# EAGLE design Node#2 (EAGLE 9.2.1)

## Sheet 1 of 5
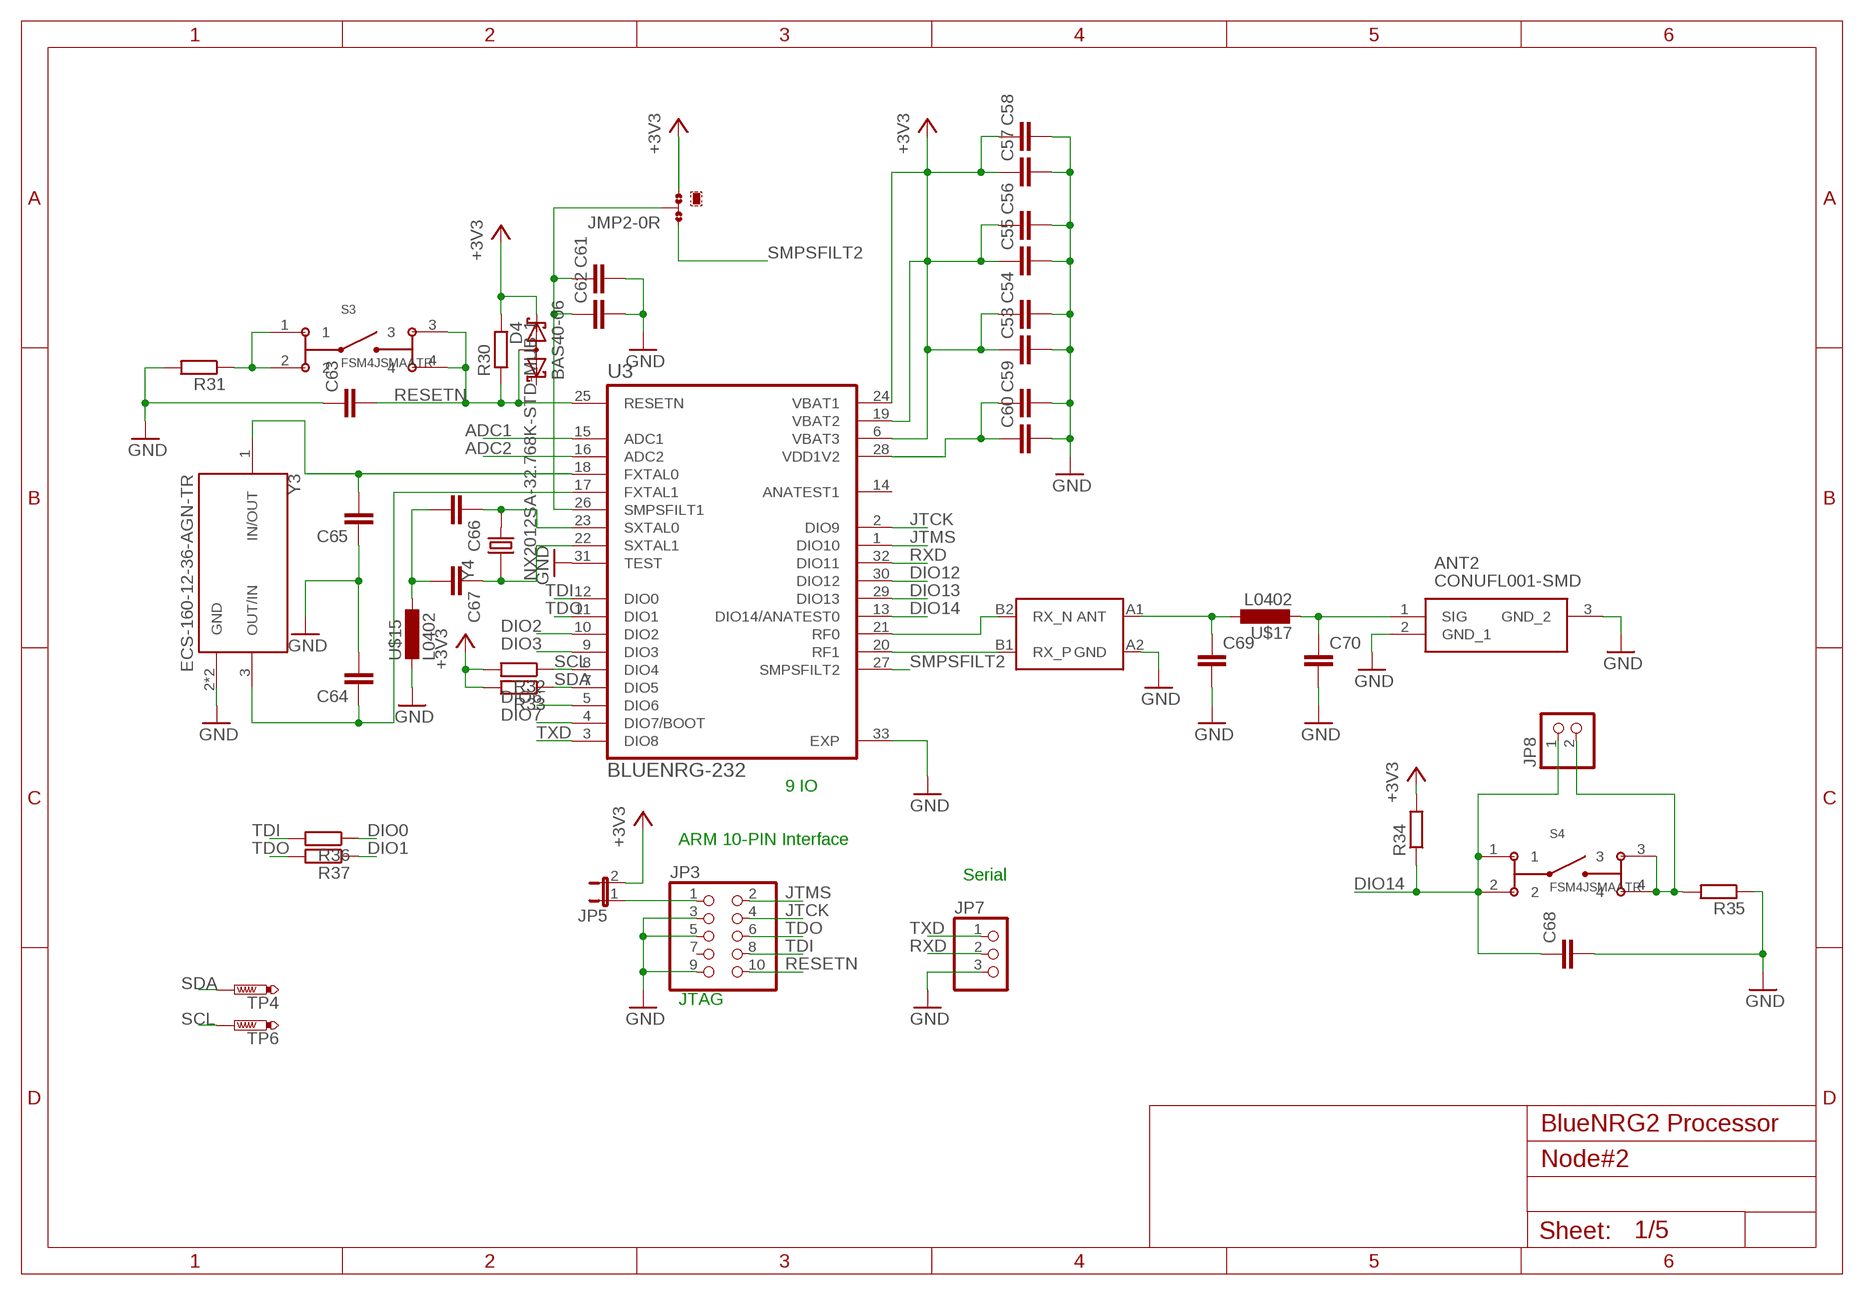
[diagram p0: schematic, sheet 1]

### Parts
ANT2  CONUFL001-SMD  [CONUFL001-SMD]
C53  C-EUC0805K  [C0805K]
C54  C-EUC0805K  [C0805K]
C55  C-EUC0805K  [C0805K]
C56  C-EUC0805K  [C0805K]
C57  C-EUC0805K  [C0805K]
C58  C-EUC0805K  [C0805K]
C59  C-EUC0805K  [C0805K]
C60  C-EUC0805K  [C0805K]
C61  C-EUC0805K  [C0805K]
C62  C-EUC0805K  [C0805K]
C63  C-EUC0805  [C0805]
C64  C-EUC0805  [C0805]
C65  C-EUC0805  [C0805]
C66  C-EUC0805  [C0805]
C67  C-EUC0805  [C0805]
C68  C-EUC0805  [C0805]
C69  C-EUC0402  [C0402]
C70  C-EUC0402  [C0402]
D4  BAS40-06  [SOT23]
JMP2  0R-JUMPA  [A0R-JMP]
JP3  PINHD-2X5  [2X05]
JP5  JP1E  [JP1]
JP7  PINHD-1X3  [1X03]
JP8  PINHD-1X2  [1X02]
R30  R-EU_R0805  [R0805]
R31  R-EU_R0805  [R0805]
R32  R-EU_R0805  [R0805]
R33  R-EU_R0805  [R0805]
R34  R-EU_R1210  [R1210]
R35  R-EU_R1210  [R1210]
R36  R-EU_R0805  [R0805]
R37  R-EU_R0805  [R0805]
S3  FSM4JSMAATR  [SW_FSM4JSMAATR]
S4  FSM4JSMAATR  [SW_FSM4JSMAATR]
TP4  PTR1TP20R  [TP20R]
TP6  PTR1TP20R  [TP20R]
U3  BLUENRG-232  [QFN50P500X500X100-33T345N]
U$15  L0402  [R0402]
U$16  BALF-NRG-01D3  [FLIPCHIP]
U$17  L0402  [R0402]
Y3  ECS-160-12-36-AGN-TR  [XTAL_ECS-160-12-36-AGN-TR]
Y4  NX2012SA-32.768K-STD-MUB-1  [XTAL_NX2012SA-32.768K-STD-MUB-1]

### Nets
+3V3: C53.1 C54.1 C55.1 C56.1 C57.1 C58.1 D4.2(K2) JMP2.3 JP5.2 R30.2 R32.2 R33.2 R34.2 U3.6(VBAT3) U3.19(VBAT2) U3.24(VBAT1) ; also sheet 2,3,4,5
ADC1: U3.15(ADC1) ; also sheet 5
ADC2: U3.16(ADC2) ; also sheet 5
DIO0: R36.1 ; also sheet 3
DIO1: R37.1 ; also sheet 3
DIO2: U3.10(DIO2) ; also sheet 3
DIO3: U3.9(DIO3) ; also sheet 5
DIO6: U3.5(DIO6) ; also sheet 5
DIO7: U3.4(DIO7/BOOT) ; also sheet 5
DIO12: U3.30(DIO12) ; also sheet 5
DIO13: U3.29(DIO13) ; also sheet 4
DIO14: C68.1 JP8.1 R34.1 S4.1 S4.2 U3.13(DIO14/ANATEST0)
GND: ANT2.2(GND_1) ANT2.3(GND_2) C53.2 C54.2 C55.2 C56.2 C57.2 C58.2 C59.2 C60.2 C61.2 C62.2 C63.1 C64.2 C65.1 C68.2 C69.2 C70.2 JP3.3 JP3.5 JP3.9 JP7.3 R31.2 R35.1 U3.31(TEST) U3.33(EXP) U$15.2 U$16.A2(GND) Y3.2(GND) Y3.4(GND) ; also sheet 2,3,4,5
JTCK: JP3.4 U3.2(DIO9)
JTMS: JP3.2 U3.1(DIO10)
N$47: C59.1 C60.1 U3.28(VDD1V2)
N$48: C61.1 C62.1 JMP2.2 U3.26(SMPSFILT1)
N$49: R31.1 S3.1 S3.2
N$50: C64.1 U3.17(FXTAL1) Y3.3(OUT/IN)
N$51: C65.2 U3.18(FXTAL0) Y3.1(IN/OUT)
N$52: C66.2 C67.2 U$15.1
N$53: C66.1 U3.23(SXTAL0) Y4.2
N$54: C67.1 U3.22(SXTAL1) Y4.1
N$55: C69.1 U$16.A1(ANT) U$17.1
N$56: ANT2.1(SIG) C70.1 U$17.2
N$57: JP3.1 JP5.1
N$58: JP8.2 R35.2 S4.3 S4.4
N$59: U3.20(RF1) U$16.B1(RX_P)
N$60: U3.21(RF0) U$16.B2(RX_N)
RESETN: C63.2 D4.3(AA) JP3.10 R30.1 S3.3 S3.4 U3.25(RESETN) ; also sheet 3,4
RXD: JP7.2 U3.32(DIO11)
SCL: R32.1 TP6.TP U3.8(DIO4) ; also sheet 4,5
SDA: R33.1 TP4.TP U3.7(DIO5) ; also sheet 4,5
SMPSFILT2: JMP2.1 U3.27(SMPSFILT2)
TDI: JP3.8 R36.2 U3.12(DIO0)
TDO: JP3.6 R37.2 U3.11(DIO1)
TXD: JP7.1 U3.3(DIO8)
Unconnected: D4.1(K1) JP3.7 U3.14(ANATEST1)

### Notes on the sheet
- 9 IO
- ARM 10-PIN Interface
- Serial
- JTAG
- BlueNRG2 Processor

## Sheet 2 of 5
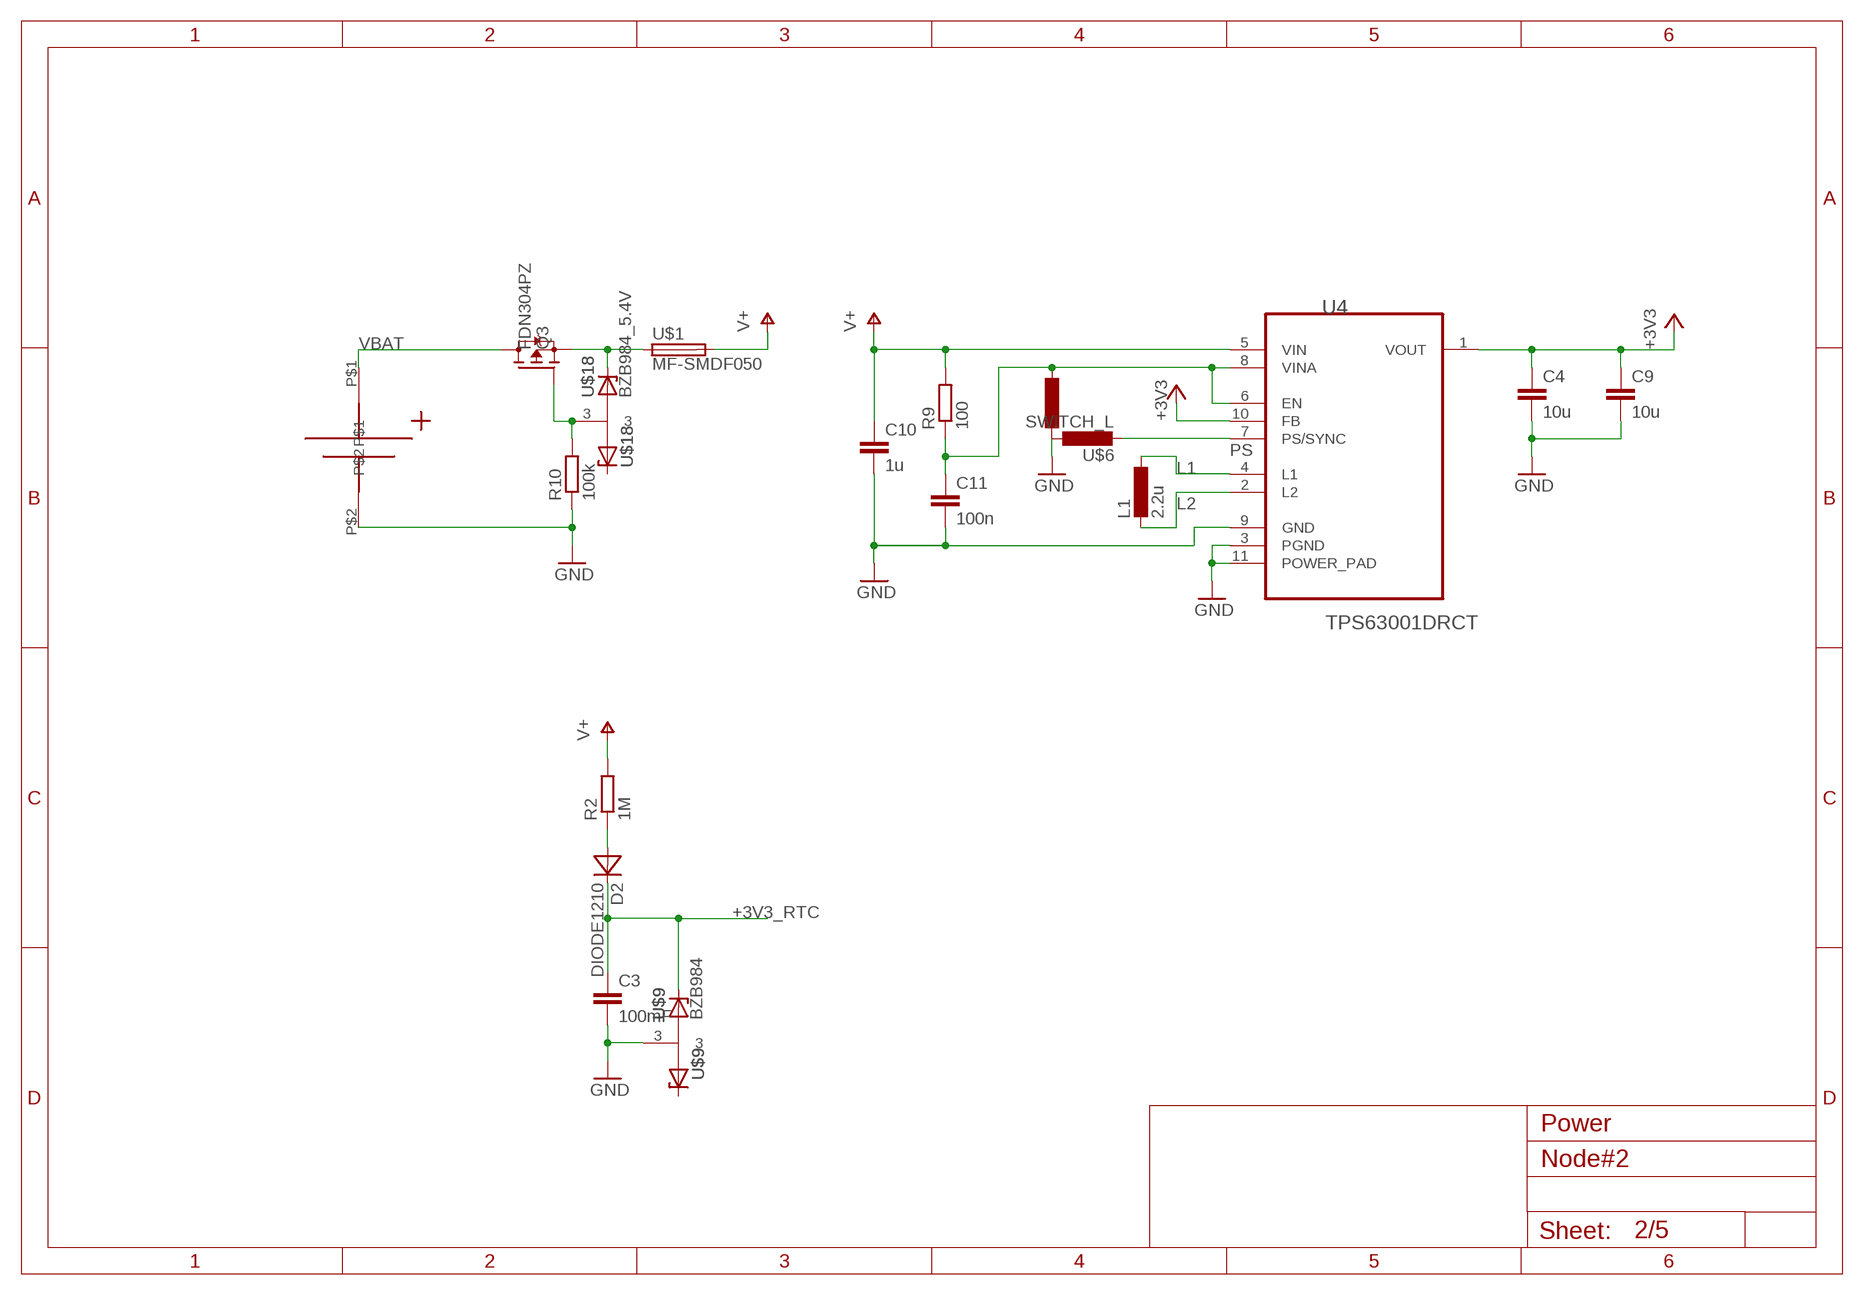
[diagram p1: schematic, sheet 2]

### Parts
C3  100mF  C-EU050-055X075  [C050-055X075]
C4  10u  C-EUC0805  [C0805]
C9  10u  C-EUC0805  [C0805]
C10  1u  C-EUC0805  [C0805]
C11  100n  C-EUC0805  [C0805]
D2  DIODE1210  [C1210]
L1  2.2u  LSWUERTH  [L5038P]
Q3  FDN304PZ  [SOT23]
R2  1M  R-EU_R0805  [R0805]
R9  100  R-EU_R0805  [R0805]
R10  100k  R-EU_R0805  [R0805]
U4  TPS63001DRCT  [SON50P300X300X100-11N]
U$1  MF-SMDF050  [MF-SMDF050]
U$6  SWITCH_L  [R0805_2]
U$9  BZB984  [SOT95P230X110-3N]
U$10  BATTER_HOLDER  [BATTERY_HOLDER]
U$18  BZB984_5.4V  BZB984  [SOT95P230X110-3N]

### Nets
+3V3: C4.1 C9.1 U4.1(VOUT) U4.10(FB) ; also sheet 1,3,4,5
+3V3_RTC: C3.1 D2.2(C) U$9.2 ; also sheet 5
GND: C3.2 C4.2 C9.2 C10.2 C11.2 R10.1 U4.3(PGND) U4.9(GND) U4.11(POWER_PAD) U$6.2 U$9.3 U$10.P$2 ; also sheet 1,3,4,5
L1: L1.1 U4.4(L1)
L2: L1.2 U4.2(L2)
N$1: D2.1(A) R2.1
N$8: Q3.2S(S) U$1.1 U$18.2
N$12: C11.1 R9.1 U4.6(EN) U4.8(VINA) U$6.3
N$14: Q3.1G(G) R10.2 U$18.3
PS: U4.7(PS/SYNC) U$6.1
V+: C10.1 R2.2 R9.2 U4.5(VIN) U$1.2 ; also sheet 5
VBAT: Q3.3D(D) U$10.P$1
Unconnected: U$9.1 U$18.1

### Notes on the sheet
- Power

## Sheet 3 of 5
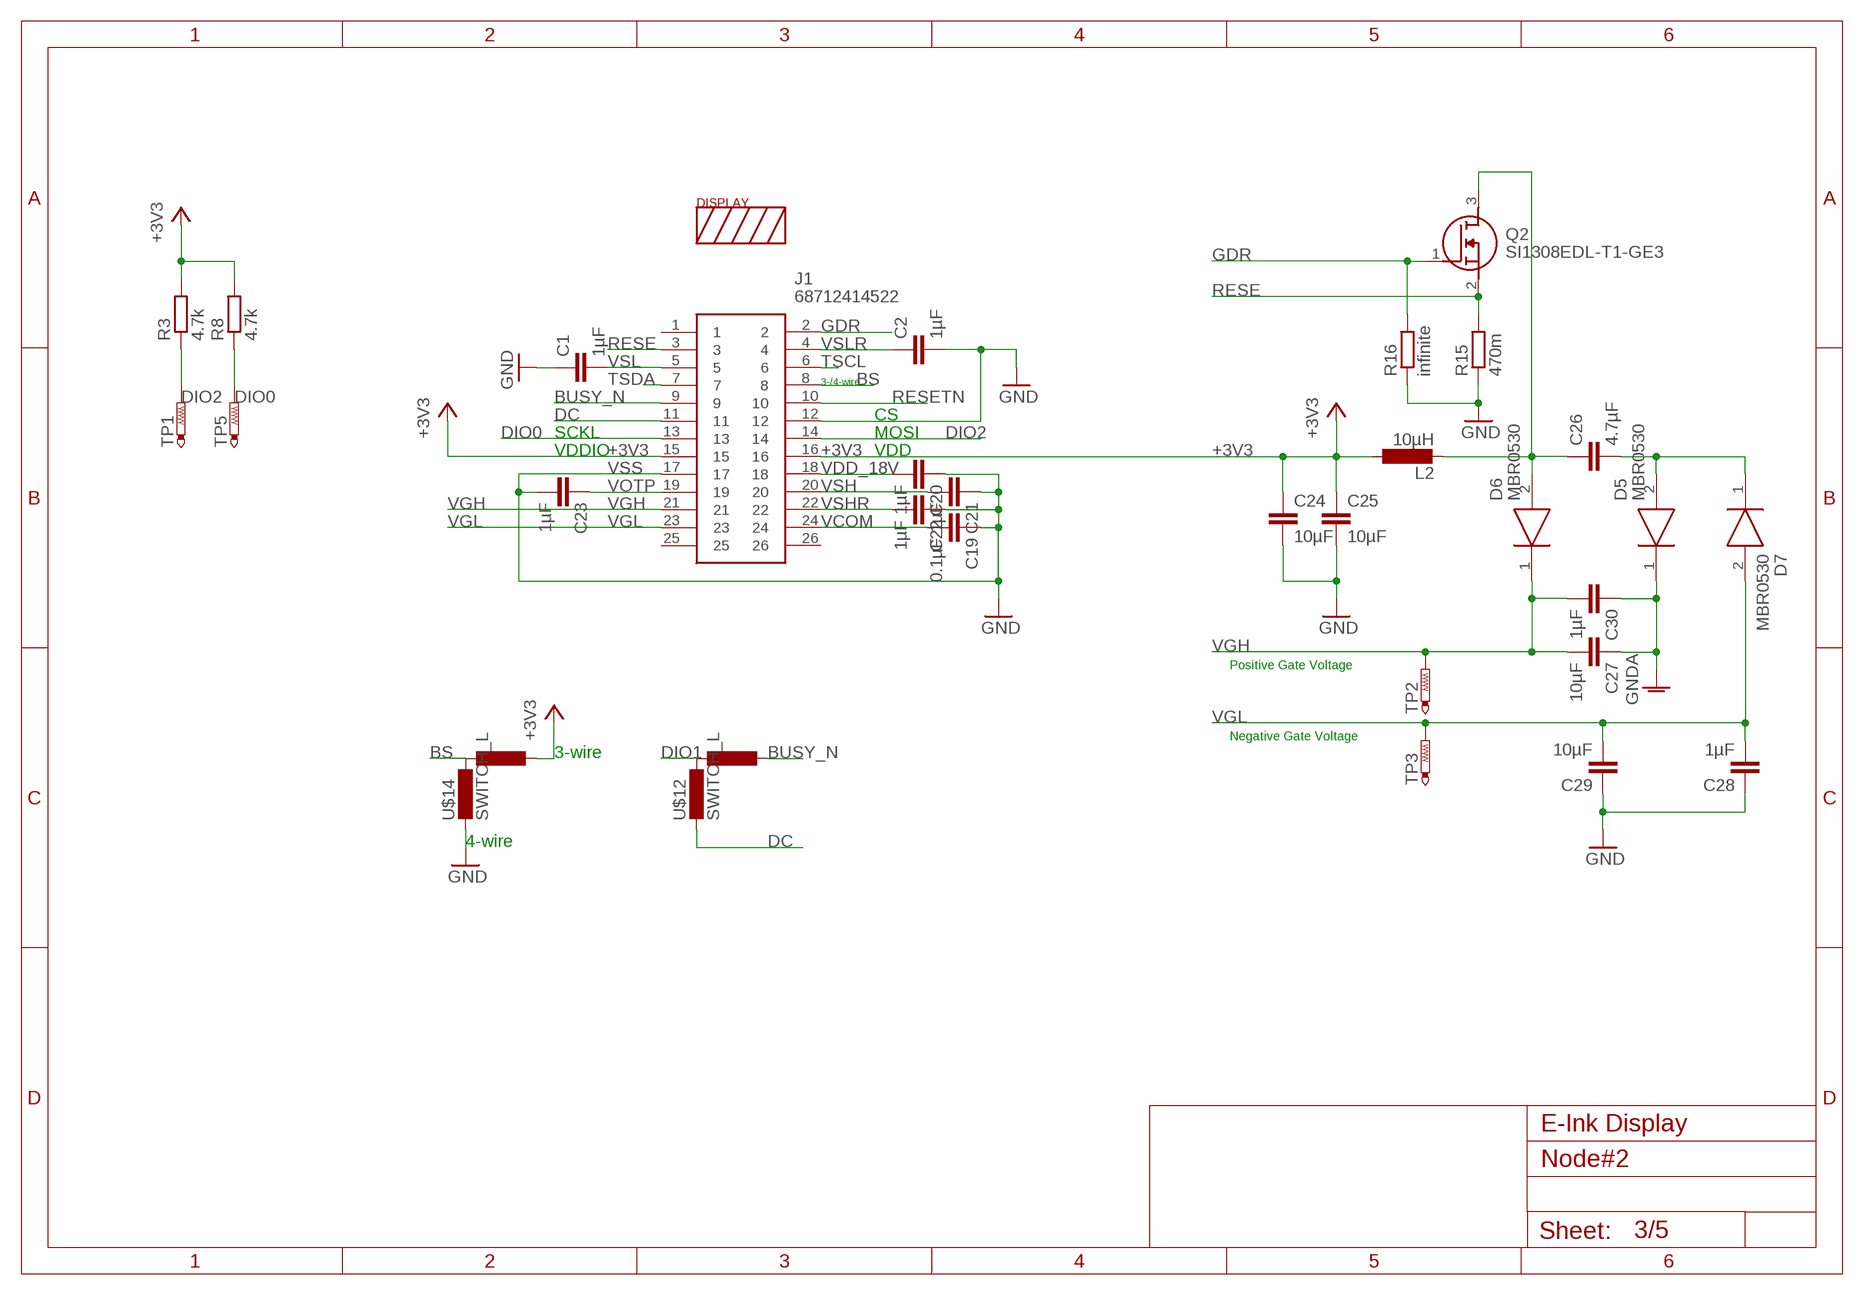
[diagram p2: schematic, sheet 3]

### Parts
C1  1µF  C-EUC0805  [C0805]
C2  1µF  C-EUC0805  [C0805]
C19  0.1µF  C-EUC0805  [C0805]
C20  1µF  C-EUC0805  [C0805]
C21  1µF  C-EUC0805  [C0805]
C22  1µF  C-EUC0805  [C0805]
C23  1µF  C-EUC0805  [C0805]
C24  10µF  C-EUC0805  [C0805]
C25  10µF  C-EUC0805  [C0805]
C26  4.7µF  C-EUC0805  [C0805]
C27  10µF  C-EUC0805  [C0805]
C28  1µF  C-EUC0805  [C0805]
C29  10µF  C-EUC0805  [C0805]
C30  1µF  C-EUC0805  [C0805]
D5  MBR0530  [SOD3716X135N]
D6  MBR0530  [SOD3716X135N]
D7  MBR0530  [SOD3716X135N]
J1  68712414522  [68712414522]
L2  10µH  LSWUERTH  [L5038P]
Q2  SI1308EDL-T1-GE3  [SOT65P210X110-3N]
R3  4.7k  R-EU_R0805  [R0805]
R8  4.7k  R-EU_R0805  [R0805]
R15  470m  R-EU_R0805  [R0805]
R16  infinite  R-EU_R0805  [R0805]
TP1  PTR1TP20R  [TP20R]
TP2  PTR1TP20R  [TP20R]
TP3  PTR1TP20R  [TP20R]
TP5  PTR1TP20R  [TP20R]
U$11  DISPLAY  [DISPLAY]
U$12  SWITCH_L  [R0805_2]
U$14  SWITCH_L  [R0805_2]

### Nets
+3V3: C24.1 C25.1 J1.15 J1.16 L2.1 R3.2 R8.2 U$14.3 ; also sheet 1,2,4,5
BS: J1.8 U$14.2
BUSY_N: J1.9 U$12.3
DC: J1.11 U$12.1
DIO0: J1.13 R8.1 TP5.TP ; also sheet 1
DIO1: U$12.2 ; also sheet 1
DIO2: J1.14 R3.1 TP1.TP ; also sheet 1
GDR: J1.2 Q2.1(G) R16.2
GND: C1.1 C2.2 C24.2 C25.2 C27.1 C28.1 C29.1 C30.1 D5.1(K) J1.12 R15.1 R16.1 U$14.1 ; supply symbol labelled GNDA ; also sheet 1,2,4,5
N$23: C26.1 D6.2(A) L2.2 Q2.3(D)
N$24: C26.2 D5.2(A) D7.1(K)
RESE: J1.3 Q2.2(S) R15.2
RESETN: J1.10 ; also sheet 1,4
TSCL: J1.6
TSDA: J1.7
VCOM: C19.2 J1.24
VDD_18V: C20.2 J1.18
VGH: C27.2 C30.2 D6.1(K) J1.21 TP2.TP
VGL: C28.2 C29.2 D7.2(A) J1.23 TP3.TP
VOTP: C23.1 J1.19
VSH: C21.2 J1.20
VSHR: C22.2 J1.22
VSL: C1.2 J1.5
VSLR: C2.1 J1.4
VSS: C19.1 C20.1 C21.1 C22.1 C23.2 J1.17 ; supply symbol labelled GND
Unconnected: J1.1 J1.25 J1.26

### Notes on the sheet
- 3-/4-wire
- CS
- SCKL | MOSI
- VDDIO | VDD
- Positive Gate Voltage
- Negative Gate Voltage
- 3-wire
- 4-wire
- E-Ink Display

## Sheet 4 of 5
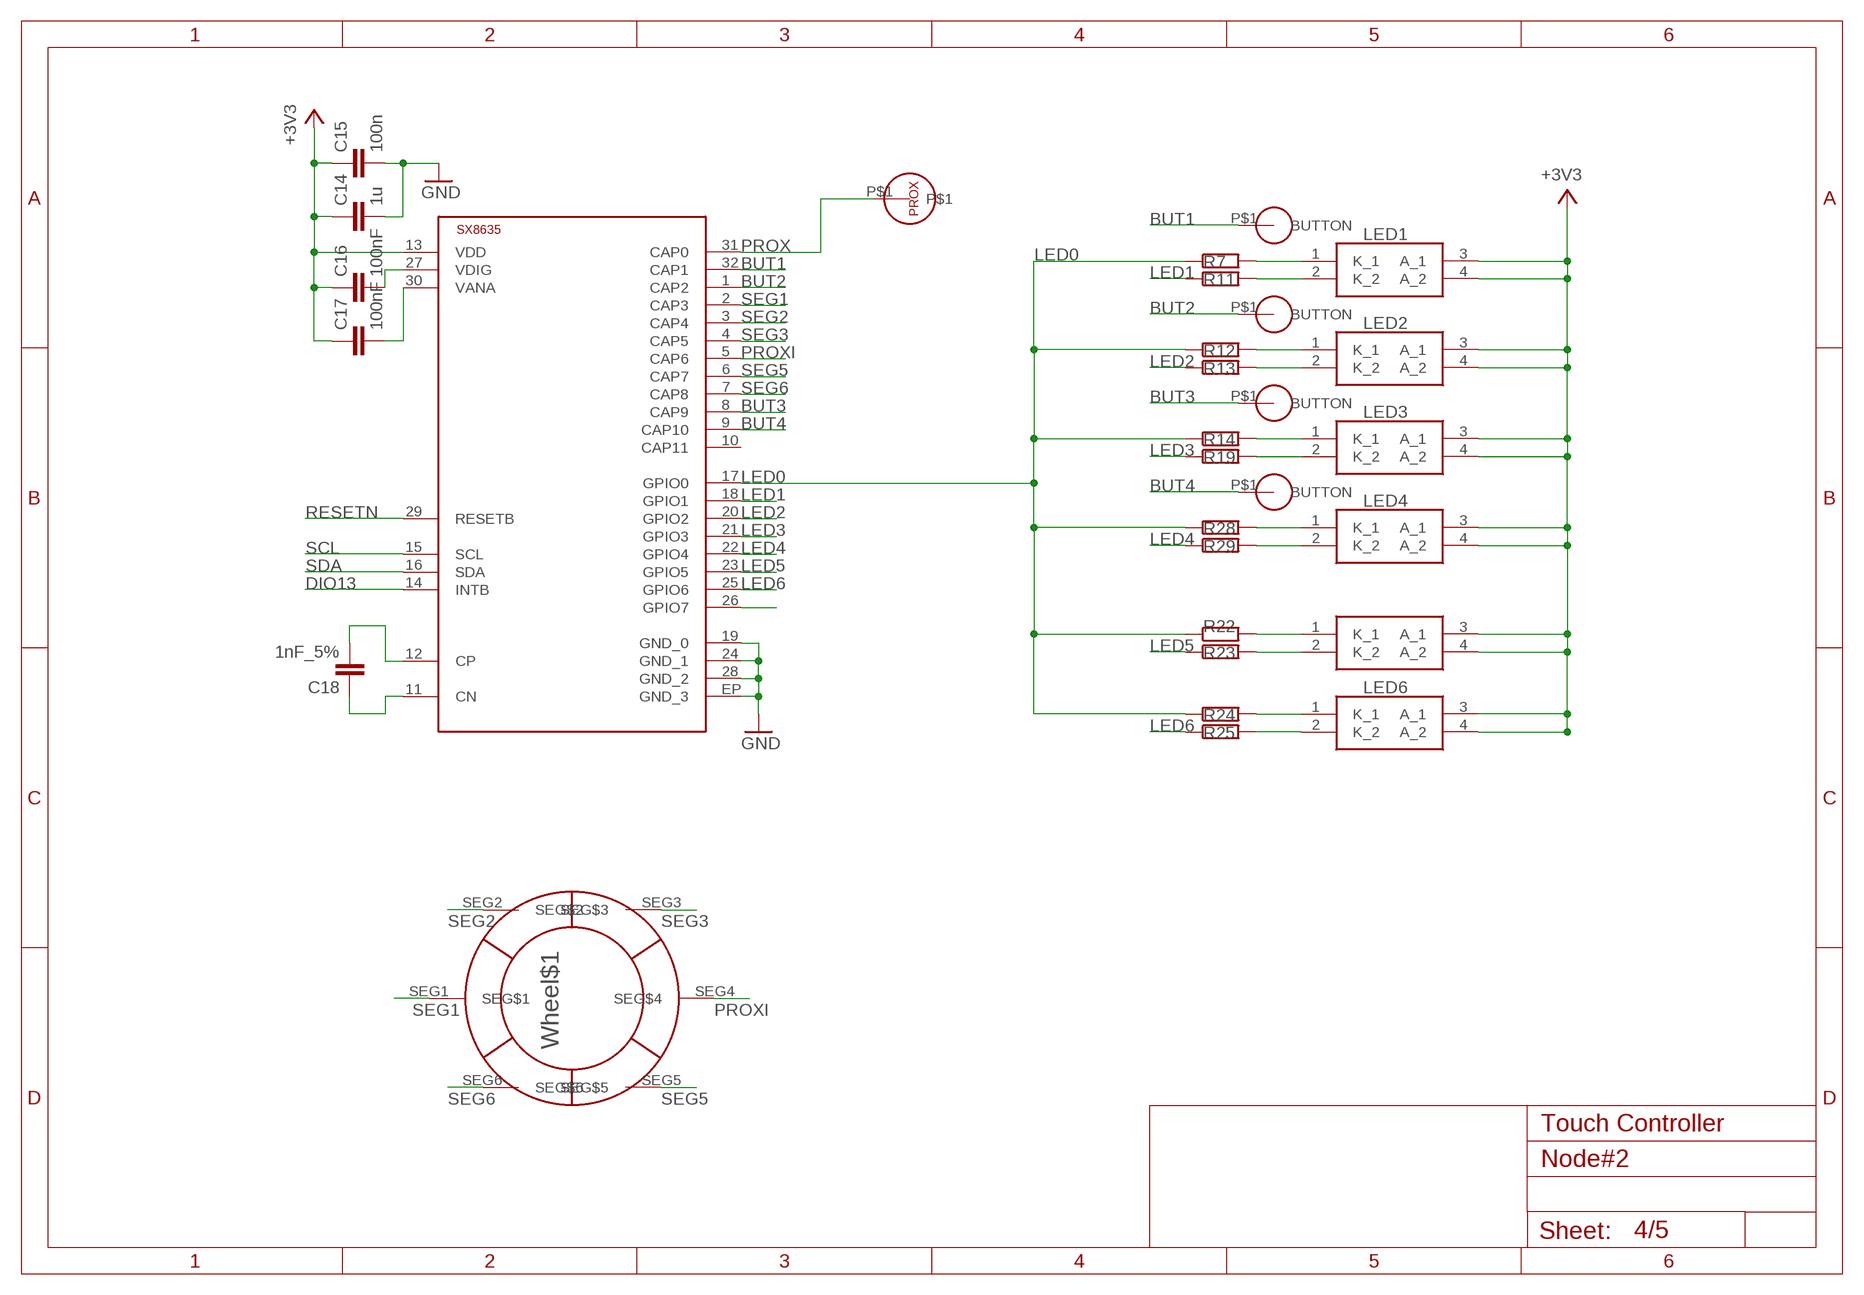
[diagram p3: schematic, sheet 4]

### Parts
C14  1u  C-EUC0805  [C0805]
C15  100n  C-EUC0805  [C0805]
C16  100nF  C-EUC0805  [C0805]
C17  100nF  C-EUC0805  [C0805]
C18  1nF_5%  C-EUC0805  [C0805]
LED1  156125YV73000  [156125YV73000]
LED2  156125YV73000  [156125YV73000]
LED3  156125YV73000  [156125YV73000]
LED4  156125YV73000  [156125YV73000]
LED5  156125YV73000  [156125YV73000]
LED6  156125YV73000  [156125YV73000]
PROXI  PROXIMITY  [PROXIMITY]
R7  R-EU_R0805  [R0805]
R11  R-EU_R0805  [R0805]
R12  R-EU_R0805  [R0805]
R13  R-EU_R0805  [R0805]
R14  R-EU_R0805  [R0805]
R19  R-EU_R0805  [R0805]
R22  R-EU_R0805  [R0805]
R23  R-EU_R0805  [R0805]
R24  R-EU_R0805  [R0805]
R25  R-EU_R0805  [R0805]
R28  R-EU_R0805  [R0805]
R29  R-EU_R0805  [R0805]
U$2  SX8635  [QFN-32]
U$3  TOUCH_BUTTON  [TOUCH_BUTTON]
U$4  TOUCH_BUTTON  [TOUCH_BUTTON]
U$5  TOUCH_BUTTON  [TOUCH_BUTTON]
U$13  TOUCH_BUTTON  [TOUCH_BUTTON]
U$19  WHEEL6  [WHEEL6]

### Nets
+3V3: C14.1 C15.1 C16.1 C17.1 LED1.3(A_1) LED1.4(A_2) LED2.3(A_1) LED2.4(A_2) LED3.3(A_1) LED3.4(A_2) LED4.3(A_1) LED4.4(A_2) LED5.3(A_1) LED5.4(A_2) LED6.3(A_1) LED6.4(A_2) U$2.13(VDD) ; also sheet 1,2,3,5
BUT1: U$2.32(CAP1) U$3.P$1(BUTTON)
BUT2: U$2.1(CAP2) U$4.P$1(BUTTON)
BUT3: U$2.8(CAP9) U$5.P$1(BUTTON)
BUT4: U$2.9(CAP10) U$13.P$1(BUTTON)
DIO13: U$2.14(INTB) ; also sheet 1
GND: C14.2 C15.2 U$2.19(GND_0) U$2.24(GND_1) U$2.28(GND_2) U$2.EP(GND_3) ; also sheet 1,2,3,5
LED0: R7.1 R12.1 R14.1 R22.1 R24.1 R28.1 U$2.17(GPIO0)
LED1: R11.1 U$2.18(GPIO1)
LED2: R13.1 U$2.20(GPIO2)
LED3: R19.1 U$2.21(GPIO3)
LED4: R29.1 U$2.22(GPIO4)
LED5: R23.1 U$2.23(GPIO5)
LED6: R25.1 U$2.25(GPIO6)
N$4: LED1.1(K_1) R7.2
N$5: LED1.2(K_2) R11.2
N$7: LED3.1(K_1) R14.2
N$13: LED3.2(K_2) R19.2
N$16: LED5.1(K_1) R22.2
N$17: LED5.2(K_2) R23.2
N$18: C16.2 U$2.27(VDIG)
N$19: C17.2 U$2.30(VANA)
N$20: C18.2 U$2.12(CP)
N$21: C18.1 U$2.11(CN)
N$25: LED2.1(K_1) R12.2
N$26: LED2.2(K_2) R13.2
N$30: LED4.1(K_1) R28.2
N$31: LED4.2(K_2) R29.2
N$35: U$2.26(GPIO7)
N$36: LED6.1(K_1) R24.2
N$37: LED6.2(K_2) R25.2
PROX: PROXI.P$1 U$2.31(CAP0)
PROXI: U$2.5(CAP6) U$19.SEG4(SEG$4)
RESETN: U$2.29(RESETB) ; also sheet 1,3
SCL: U$2.15(SCL) ; also sheet 1,5
SDA: U$2.16(SDA) ; also sheet 1,5
SEG1: U$2.2(CAP3) U$19.SEG1(SEG$1)
SEG2: U$2.3(CAP4) U$19.SEG2(SEG$2)
SEG3: U$2.4(CAP5) U$19.SEG3(SEG$3)
SEG5: U$2.6(CAP7) U$19.SEG5(SEG$5)
SEG6: U$2.7(CAP8) U$19.SEG6(SEG$6)
Unconnected: U$2.10(CAP11)

### Notes on the sheet
- Touch Controller

## Sheet 5 of 5
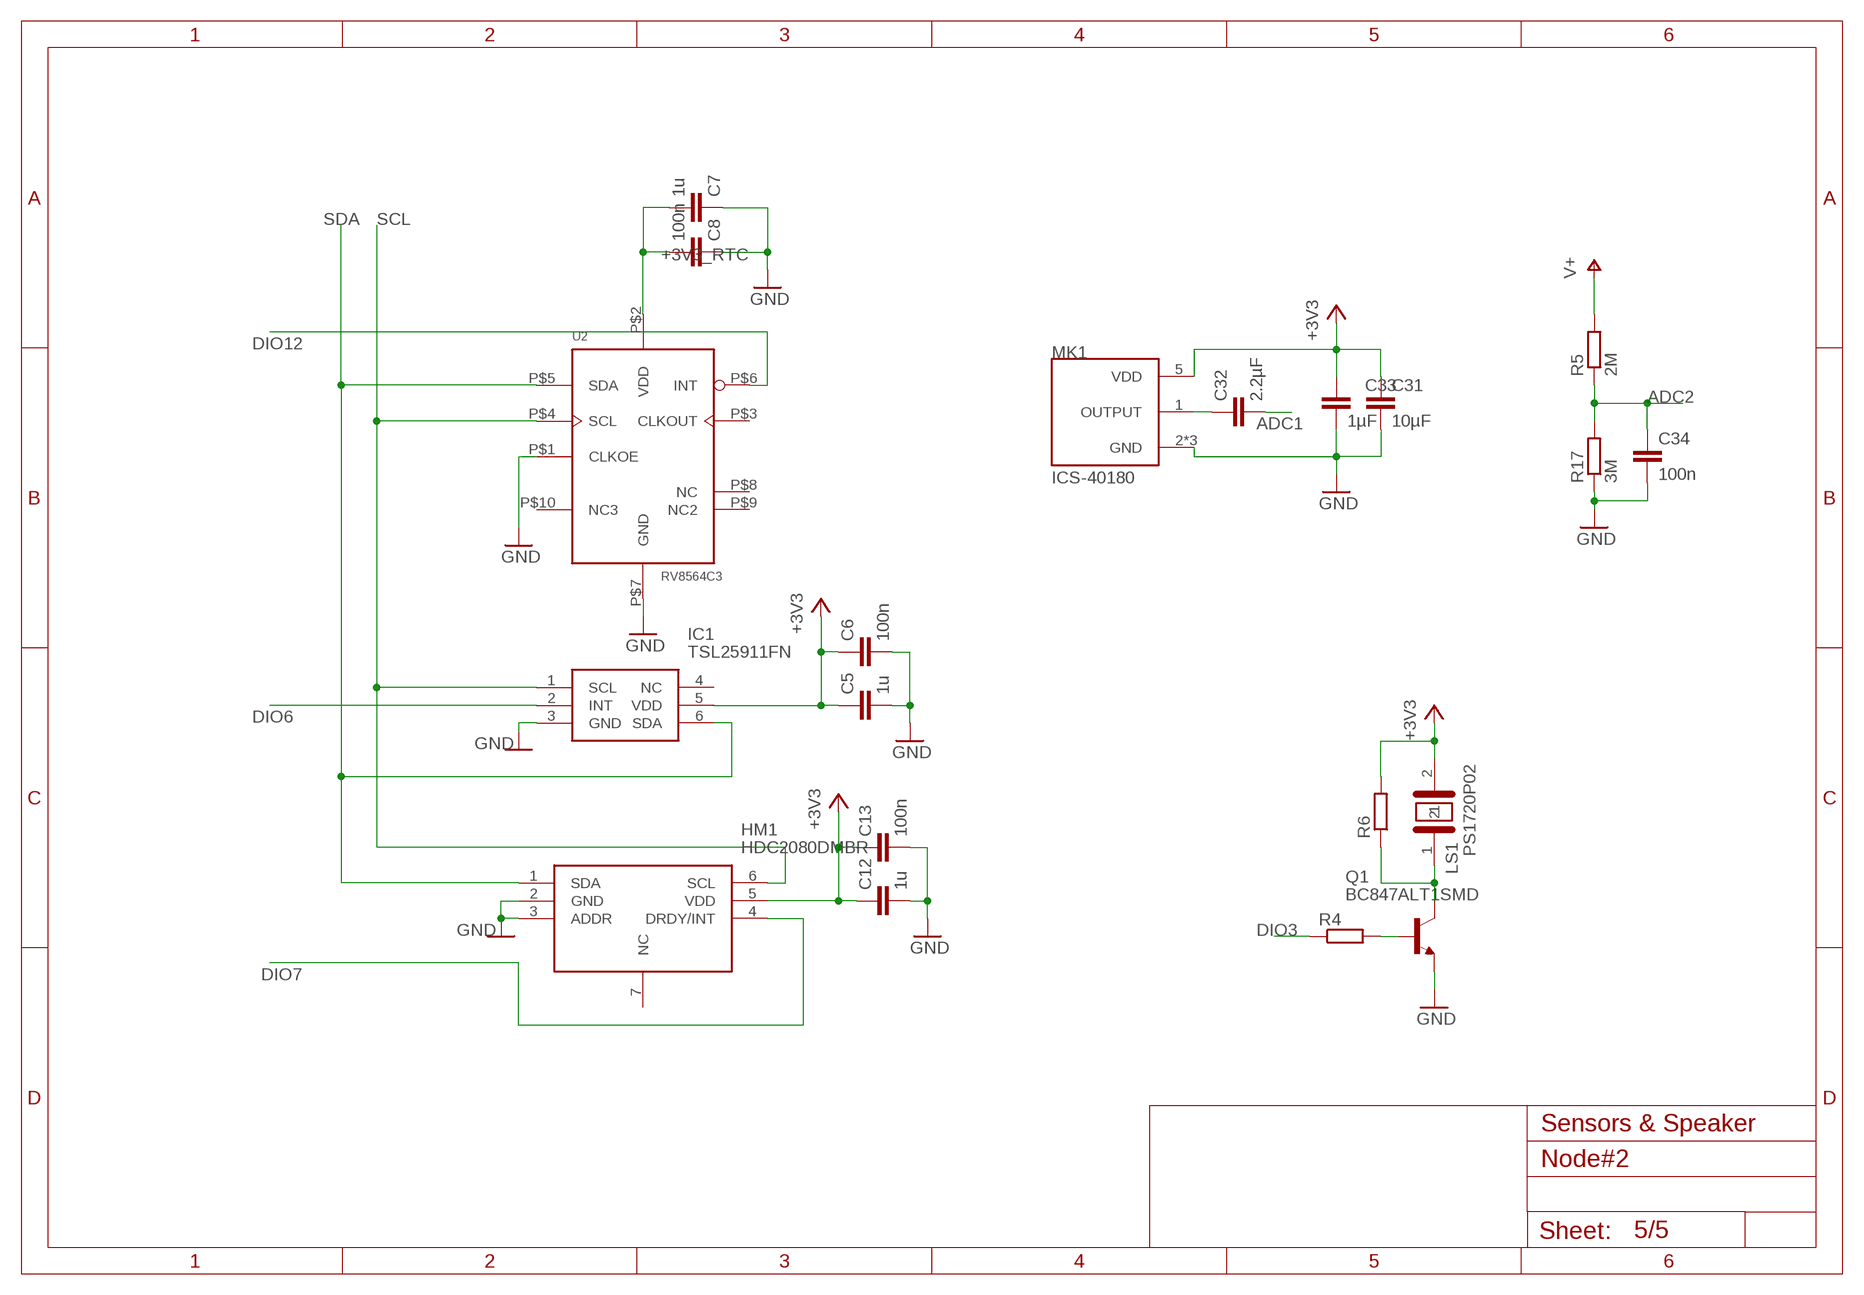
[diagram p4: schematic, sheet 5]

### Parts
C5  1u  C-EUC0805  [C0805]
C6  100n  C-EUC0805  [C0805]
C7  1u  C-EUC0805  [C0805]
C8  100n  C-EUC0805  [C0805]
C12  1u  C-EUC0805  [C0805]
C13  100n  C-EUC0805  [C0805]
C31  10µF  C-EUC0805  [C0805]
C32  2.2µF  C-EUC0805  [C0805]
C33  1µF  C-EUC0805  [C0805]
C34  100n  C-EUC0805  [C0805]
HM1  HDC2080DMBR  [SON100P300X300X80-7N]
IC1  TSL25911FN  [TSL25911FN]
LS1  PS1720P02  [PS17_1]
MK1  ICS-40180  [MIC_ICS-40180]
Q1  BC847ALT1SMD  [SOT23]
R4  R-EU_R0805  [R0805]
R5  2M  R-EU_R0805  [R0805]
R6  R-EU_R0805  [R0805]
R17  3M  R-EU_R0805  [R0805]
U2  RV8564C3  [RTC-C3]

### Nets
+3V3: C5.1 C6.1 C12.1 C13.1 C31.1 C33.1 HM1.5(VDD) IC1.5(VDD) LS1.2 MK1.5(VDD) R6.2 ; also sheet 1,2,3,4
+3V3_RTC: C7.2 C8.2 U2.P$2(VDD) ; also sheet 2
ADC1: C32.2 ; also sheet 1
ADC2: C34.1 R5.1 R17.2 ; also sheet 1
DIO3: R4.1 ; also sheet 1
DIO6: IC1.2(INT) ; also sheet 1
DIO7: HM1.4(DRDY/INT) ; also sheet 1
DIO12: U2.P$6(INT) ; also sheet 1
GND: C5.2 C6.2 C7.1 C8.1 C12.2 C13.2 C31.2 C33.2 C34.2 HM1.2(GND) HM1.3(ADDR) IC1.3(GND) MK1.2(GND) MK1.3(GND) MK1.4(GND) Q1.2(E) R17.1 U2.P$1(CLKOE) U2.P$7(GND) ; also sheet 1,2,3,4
N$2: C32.1 MK1.1(OUTPUT)
N$3: LS1.1 Q1.3(C) R6.1
N$6: Q1.1(B) R4.2
SCL: HM1.6(SCL) IC1.1(SCL) U2.P$4(SCL) ; also sheet 1,4
SDA: HM1.1(SDA) IC1.6(SDA) U2.P$5(SDA) ; also sheet 1,4
V+: R5.2 ; also sheet 2
Unconnected: HM1.7(NC) IC1.4(NC) U2.P$3(CLKOUT) U2.P$8(NC) U2.P$9(NC2) U2.P$10(NC3)

### Notes on the sheet
- Sensors & Speaker

## Library data of the parts
ANT2 = BlueHome:CONUFL001-SMD: RF Connectors / Coaxial Connectors U.FL Straight Surface Mount Jack Source: Datasheet <https://componentsearchengine.com/Datasheets/1/CONUFL001-SMD.pdf>; DESCRIPTION: RF Connectors / Coaxial Connectors U.FL Straight Surface Mount Jack; HEIGHT: mm; MANUFACTURER_NAME: Linx Technologies; MANUFACTURER_PART_NUMBER: CONUFL001-SMD; MOUSER_PART_NUMBER: 712-CONUFL001-SMD
C1 C2 C19-C30 = rcl:C-EU: CAPACITOR, European symbol; SPICEPREFIX: C
C3-C18 C31-C34 C53-C70 = rcl:C-EU: CAPACITOR, European symbol
D2 = BlueHome:DIODE1210
D4 = diode:BAS40-06: Silicon Schottky Diodes General-purpose diode for high-speed switching
D5-D7 = BlueHome:MBR0530: ON SEMICONDUCTOR - MBR0530 - DIODE, SCHOTTKY, 0.5A, 30V, SOD-123 Source: Datasheet <https://www.mouser.com/datasheet/2/308/MBR0530-1301245.pdf>; DESCRIPTION: ON SEMICONDUCTOR - MBR0530 - DIODE, SCHOTTKY, 0.5A, 30V, SOD-123; HEIGHT: 1.35mm; MANUFACTURER_NAME: ON Semiconductor; MANUFACTURER_PART_NUMBER: MBR0530; MOUSER_PART_NUMBER: 512-MBR0530; SPICEPREFIX: D
HM1 = BlueHome:HDC2080DMBR: Board Mount Humidity Sensors Low Power Humidity and Temperature Digital Sensor 6-WSON -40 to 85 Source: Datasheet <http://www.ti.com/general/docs/suppproductinfo.tsp?distId=26&gotoUrl=http://www.ti.com/lit/ds/symlink/hdc2080.pdf>; DESCRIPTION: Board Mount Humidity Sensors Low Power Humidity and Temperature Digital Sensor 6-WSON -40 to 85; HEIGHT: 0.8mm; MANUFACTURER_NAME: Texas Instruments; MANUFACTURER_PART_NUMBER: HDC2080DMBR; MOUSER_PART_NUMBER: 595-HDC2080DMBR
IC1 = BlueHome:TSL25911FN: Sensitivity Ambient Light Sensor DFN6 Source: Datasheet <https://componentsearchengine.com/Datasheets/1/TSL25911FN.pdf>; DESCRIPTION: Sensitivity Ambient Light Sensor DFN6; HEIGHT: 0mm; MANUFACTURER_NAME: ams; MANUFACTURER_PART_NUMBER: TSL25911FN; MOUSER_PART_NUMBER: 985-TSL25911FN
J1 = BlueHome:68712414522: WR-FPC 0.5mm ZIF Connector Bottom 24pin Wurth Elektronik 687 Series 0.5mm Pitch 24 Way Straight SMT FPC Connector Source: Datasheet <https://componentsearchengine.com/Datasheets/1/68712414522.pdf>; DESCRIPTION: WR-FPC 0.5mm ZIF Connector Bottom 24pin Wurth Elektronik 687 Series 0.5mm Pitch 24 Way Straight SMT FPC Connector; HEIGHT: 2mm; MANUFACTURER_NAME: Wurth Elektronik; MANUFACTURER_PART_NUMBER: 68712414522; MOUSER_PART_NUMBER: 710-68712414522; SPICEPREFIX: X
JMP2 = jump-0r-smd:0R-JUMP: SMD 0R 0805 Jumper
JP3 = pinhead:PINHD-2X5: PIN HEADER
JP5 = jumper:JP1E: JUMPER
JP7 = pinhead:PINHD-1X3: PIN HEADER
JP8 = pinhead:PINHD-1X2: PIN HEADER
L1 = BlueHome:LSWUERTH; SPICEPREFIX: L
L2 = BlueHome:LSWUERTH
LED1-LED6 = BlueHome:156125YV73000: Standard LEDs - SMD WL-SBRW SMD 1205 YBG 592/573nm Source: Datasheet <https://componentsearchengine.com/Datasheets/1/156125YV73000.pdf>; DESCRIPTION: Standard LEDs - SMD WL-SBRW SMD 1205 YBG 592/573nm; HEIGHT: 0.8mm; MANUFACTURER_NAME: Wurth Elektronik; MANUFACTURER_PART_NUMBER: 156125YV73000; MOUSER_PART_NUMBER: 710-156125YV73000
LS1 = BlueHome:PS1720P02: Piezoelectronic buzzers Pin terminal/Lead lines/SMD(Without oscillator circuit) Source: Datasheet <https://componentsearchengine.com/Datasheets/1/PS1720P02.pdf>; DESCRIPTION: Piezoelectronic buzzers Pin terminal/Lead lines/SMD(Without oscillator circuit); HEIGHT: mm; MANUFACTURER_NAME: TDK; MANUFACTURER_PART_NUMBER: PS1720P02; MOUSER_PART_NUMBER: 810-PS1720P02
MK1 = BlueHome:ICS-40180: RF Hardened, Low Noise Analog Output; AVAILABILITY: Unavailable; DESCRIPTION: RF Hardened, Low Noise Analog Output; MF: TDK InvenSense; MP: ICS-40180; PACKAGE: LGA-5 TDK-InvenSense; PRICE: None
PROXI = BlueHome:PROXIMITY
Q1 = transistor-npn:BC847*: NPN Transistor
Q2 = BlueHome:SI1308EDL-T1-GE3: MOSFET N-Ch 30V 1.5A TrenchFET SC70 Vishay Si1308EDL-T1-GE3 N-channel MOSFET Transistor, 1.5 A, 30 V, 3-Pin SC-70 Source: Datasheet <https://componentsearchengine.com/Datasheets/1/SI1308EDL-T1-GE3.pdf>; DESCRIPTION: MOSFET N-Ch 30V 1.5A TrenchFET SC70 Vishay Si1308EDL-T1-GE3 N-channel MOSFET Transistor, 1.5 A, 30 V, 3-Pin SC-70; HEIGHT: 1.1mm; MANUFACTURER_NAME: Vishay; MANUFACTURER_PART_NUMBER: Si1308EDL-T1-GE3; MOUSER_PART_NUMBER: 78-SI1308EDL-T1-GE3; SPICEPREFIX: Q
Q3 = BlueHome:FDN304PZ
R2-R6 R8-R10 R17 R30-R37 = rcl:R-EU_: RESISTOR, European symbol
R7 R11-R16 R19 R22-R25 R28 R29 = rcl:R-EU_: RESISTOR, European symbol; SPICEPREFIX: R
S3 S4 = BlueHome:FSM4JSMAATR: Switch Tactile OFF (ON) SPST Round Button Gull Wing 0.05A 24VDC 2.6N SMD T/R; AVAILABILITY: Unavailable; DESCRIPTION: Switch Tactile OFF _ON_ SPST Round Button Gull Wing 0.05A 24VDC 2.6N SMD T/R; MF: TE Connectivity; MP: FSM4JSMAATR; PACKAGE: None; PRICE: None; TE_PURCHASE_URL: https://www.te.com/usa-en/product-FSM4JSMAATR.html?te_bu=Cor&te_type=disp&te_campaign=seda_glo_cor-seda-global-disp-prtnr-fy19-seda-model-bom-cta_sma-317_1&elqCampaignId=32493
TP1-TP6 = testpad:PTR1: TEST PIN
U2 = BlueHome:RV8564C3: Real Time Clock |SM| 3.7 x 2.5 mm | I2C Bus Sub miniature size AEC Q200 Rev C compliant Compliant with I2C-Bus interface (400kHz) Built in crystal for adjustment-free operation Programmable alarm, timer and interrupt functions Low power consumption datasheet <http://www.golledge.com/docs/products/rtcs/rv8564c3.htm?src=eagle>; AVAILABILITY: Unavailable; DESCRIPTION: Rtc Module 20ppm -40/+85; MF: Micro Crystal; MP: RV-8564-C3; PACKAGE: None; PRICE: None
U3 = BlueHome:BLUENRG-232: Bluetooth Low Energy Wireless Soc; AVAILABILITY: Unavailable; DESCRIPTION: Bluetooth Low Energy Wireless Soc; MF: STMicroelectronics; MP: BLUENRG-232; PACKAGE: VFQFN-32 STMicroelectronics; PRICE: None
U4 = BlueHome:TPS63001DRCT: HIGH EFFICIENT SINGLE INDUCTOR BUCK-BOOST CONVERTER WITH 1.8-A SWITCHES; AVAILABILITY: Unavailable; DESCRIPTION: 96% Buck-Boost Converter with 1.7A Current Switches, 3.3V fixed Output voltage in 3x3 QFN 10-VSON -40 to 85; MF: Texas Instruments; MP: TPS63001DRCT; PACKAGE: VSON-10 Texas Instruments; PRICE: None
U$1 = fuse:MF-SMDF: MF-SMDF Series - PRC Resettable Fuses Source: http://www.farnell.com/datasheets/716597.pdf
U$2 = BlueHome:SX8635
U$3-U$5 U$13 = BlueHome:TOUCH_BUTTON
U$6 U$12 U$14 = BlueHome:SWITCH_L
U$9 U$18 = BlueHome:BZB984
U$10 = BlueHome:BATTER_HOLDER
U$11 = BlueHome:DISPLAY; SPICEPREFIX: X
U$15 U$17 = BlueHome:L
U$16 = BlueHome:BALF-NRG-01D3; AVAILABILITY: Unavailable; DESCRIPTION: 50 Ω nominal input / conjugate match balun to BlueNRG transceiver, with integrated harmonic filter; MF: STMicroelectronics; MP: BALF-NRG-01D3; PACKAGE: WFBGA-4 STMicroelectronics; PRICE: None
U$19 = BlueHome:WHEEL6
Y3 = BlueHome:ECS-160-12-36-AGN-TR: The minature ECX-2236 is a compact SMD Crystal. The industry standard 2.5 x 2.0 x 0.55 mm ceramic package is ideal for today’s SMD manufacturing environment.; AVAILABILITY: Unavailable; DESCRIPTION: Crystal 16MHz ±25ppm _Tol_ ±30ppm _Stability_ 12pF FUND 80Ohm 4-Pin Mini-CSMD T/R; MF: ECS Inc.; MP: ECS-160-12-36-AGN-TR; PACKAGE: SMD-4 ECS International; PRICE: None
Y4 = BlueHome:NX2012SA-32.768K-STD-MUB-1: Crystal 32.7680khz 12.5pf Smd; AVAILABILITY: Unavailable; DESCRIPTION: Crystal 32.7680khz 12.5pf Smd; MF: NDK America,; MP: NX2012SA-32.768K-STD-MUB-1; PACKAGE: SMD-2 NDK; PRICE: None

## Module DISPLAY
Ports: 

### Library data of the parts

## Board
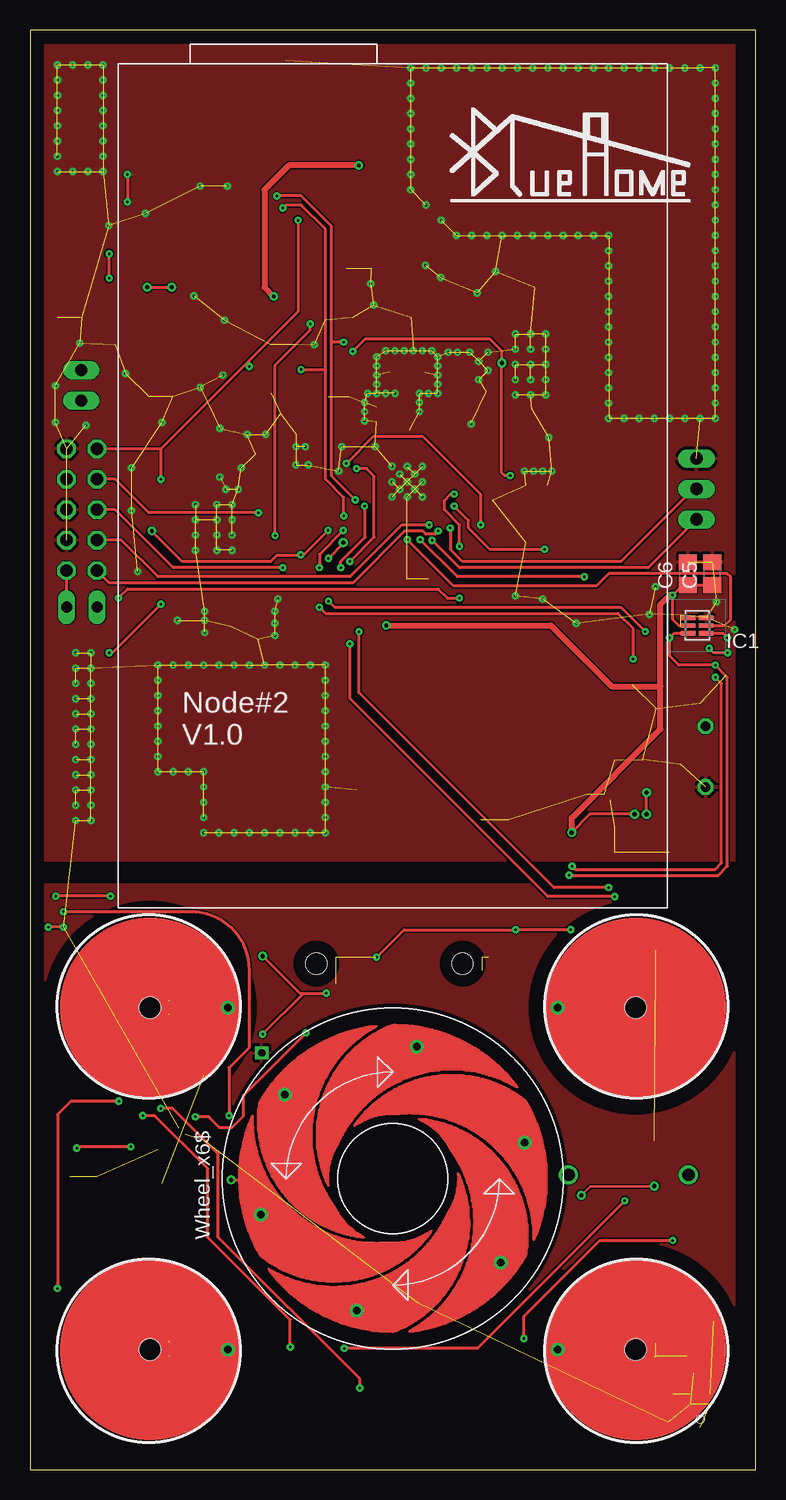
[diagram p5: board, top side]
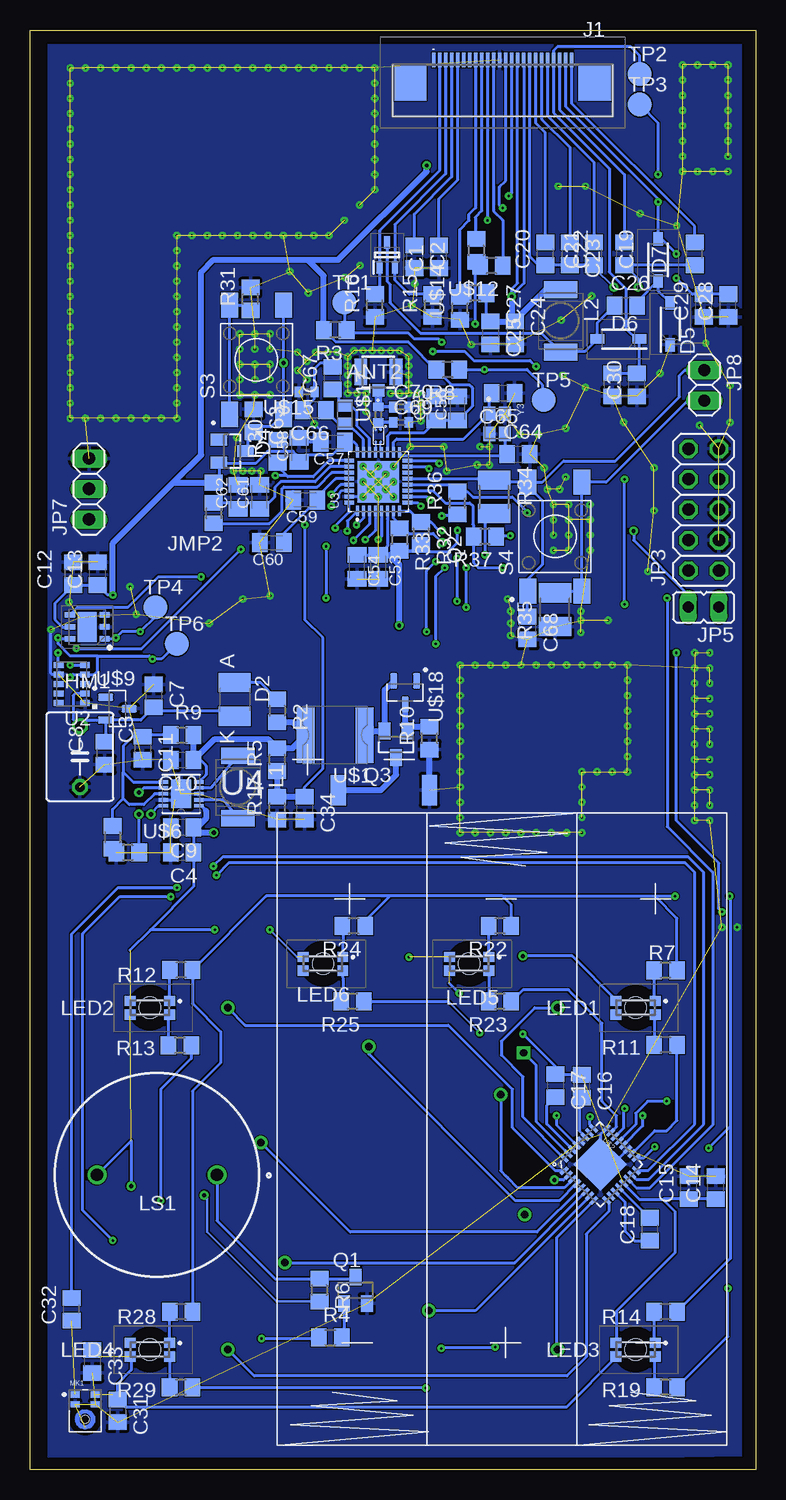
[diagram p6: board, bottom side, seen from below]

Size 60.5 x 120 mm. Coordinates in mm from the lower left corner, seen from the top.
Outline: 0,0 60.5,0 60.5,120 0,120 0,0
Copper layers (1*16): Top 0.035mm / dielectric 1.5mm / Bottom 0.035mm
Design rules "default *": minimum track width 8mil, minimum drill 8mil, track to track 4mil, track to pad 4mil, pad to pad 4mil, via to via 4mil, smd to smd 4mil, copper to edge 40mil, drill to drill 6mil, minimum pad ring 10mil, minimum via ring 8mil, stop-mask expansion 4mil, vias tented up to drill 0mil, thermal gap 10mil
Holes 1.75 mm at 23.88,42.16 36.07,42.16
tRestrict: area 0,0 to 60.5,120
bRestrict: area 0,0 to 60.5,120

### Footprints (pad centres in the part's own frame; a part is rotated, then mirrored left to right if it is on the bottom)
CONUFL001-SMD = smd 1 x 1.05: 1 0,-1.525 | smd 1.05 x 2.2: 2 -1.475,0; 3 1.475,0
C0805 = smd 1.3 x 1.5: 1 -0.95,0; 2 0.95,0
C050-055X075 = drill 0.813 octagon: 1 -2.54,0; 2 2.54,0
C0805K = smd 1.3 x 1.6: 1 -1,0; 2 1,0
C0402 = smd 0.7 x 0.9: 1 -0.65,0; 2 0.65,0
C1210 = smd 1.6 x 2.7: 1 -1.4,0; 2 1.4,0
SOT23 = smd 1 x 1.4: 1 -0.95,-1.1; 2 0.95,-1.1; 3 0,1.1
SOD3716X135N = smd 1.15 x 0.8: 1 -1.75,0; 2 1.75,0
SON100P300X300X80-7N = smd 0.85 x 0.45: 1 -1.45,1; 2 -1.45,0; 3 -1.45,-1; 4 1.45,-1; 5 1.45,0; 6 1.45,1 | smd 1.6 x 2.5: 7 0,0
TSL25911FN = smd 1.2 x 0.35: 1 -0.75,0.65; 2 -0.75,0; 3 -0.75,-0.65; 4 0.75,-0.65; 5 0.75,0; 6 0.75,0.65
68712414522 = smd 0.3 x 1.2: 1 -5.75,1.875; 2 -5.25,1.875; 3 -4.75,1.875; 4 -4.25,1.875; 5 -3.75,1.875; 6 -3.25,1.875; 7 -2.75,1.875; 8 -2.25,1.875; 9 -1.75,1.875; 10 -1.25,1.875; 11 -0.75,1.875; 12 -0.25,1.875; 13 0.25,1.875; 14 0.75,1.875; 15 1.25,1.875; 16 1.75,1.875; 17 2.25,1.875; 18 2.75,1.875; 19 3.25,1.875; 20 3.75,1.875; 21 4.25,1.875; 22 4.75,1.875; 23 5.25,1.875; 24 5.75,1.875 | smd 2.7 x 3: 25 -7.68,-0.025; 26 7.68,-0.025
A0R-JMP = smd 1.5 x 1.3: 1 0,1.7; 2 0,0; 3 0,-1.7
2X05 = drill 1.016 octagon: 1 -5.08,-1.27; 2 -5.08,1.27; 3 -2.54,-1.27; 4 -2.54,1.27; 5 0,-1.27; 6 0,1.27; 7 2.54,-1.27; 8 2.54,1.27; 9 5.08,-1.27; 10 5.08,1.27
JP1 = drill 0.914 long: 1 0,-1.27; 2 0,1.27
1X03 = drill 1.016 long: 1 -2.54,0; 2 0,0; 3 2.54,0
1X02 = drill 1.016 long: 1 -1.27,0; 2 1.27,0
L5038P = smd 1.4 x 2.8: 1 -2.6,0; 2 2.6,0
156125YV73000 = smd 0.9 x 0.85: 1 -1.65,-0.575; 2 -1.65,0.575; 3 1.65,0.575; 4 1.65,-0.575
PS17_1 = drill 1.02 pad 1.58: 1 -5,0; 2 5,0
MIC_ICS-40180 = smd 0.725 x 0.522: 1 -0.838,1.361; 2 -0.838,0.539; 4 0.838,0.539; 5 0.838,1.361 | smd 0.2 x 0.2: 3 -0.015,-1.383 | hole 0.65: 0,-0.713
PROXIMITY = drill 0.6 square: P$1 0,0
SOT65P210X110-3N = smd 1.05 x 0.5: 1 -1.05,0.65; 2 -1.05,-0.65; 3 1.05,0
SOT23' = smd 1 x 1.4: 1G -0.95,-1.1; 2S 0.95,-1.1; 3D 0,1.1
R0805 = smd 1.3 x 1.5: 1 -0.95,0; 2 0.95,0
R1210 = smd 1.6 x 2.7: 1 -1.4,0; 2 1.4,0
SW_FSM4JSMAATR = smd 2.1 x 1.4: 1 -4.55,2.25; 2 4.55,2.25; 3 -4.55,-2.25; 4 4.55,-2.25
TP20R = smd 2 x 2: TP 0,0
RTC-C3 = smd 0.8 x 0.5: P$1 -1.1,1.6; P$2 -1.1,0.8; P$3 -1.1,0; P$4 -1.1,-0.8; P$5 -1.1,-1.6; P$6 1.1,-1.6; P$7 1.1,-0.8; P$8 1.1,0; P$9 1.1,0.8; P$10 1.1,1.6
QFN50P500X500X100-33T345N = smd 0.84 x 0.29: 1 -2.435,1.75; 2 -2.435,1.25; 3 -2.435,0.75; 4 -2.435,0.25; 5 -2.435,-0.25; 6 -2.435,-0.75; 7 -2.435,-1.25; 8 -2.435,-1.75; 17 2.435,-1.75; 18 2.435,-1.25; 19 2.435,-0.75; 20 2.435,-0.25; 21 2.435,0.25; 22 2.435,0.75; 23 2.435,1.25; 24 2.435,1.75 | smd 0.29 x 0.84: 9 -1.75,-2.435; 10 -1.25,-2.435; 11 -0.75,-2.435; 12 -0.25,-2.435; 13 0.25,-2.435; 14 0.75,-2.435; 15 1.25,-2.435; 16 1.75,-2.435; 25 1.75,2.435; 26 1.25,2.435; 27 0.75,2.435; 28 0.25,2.435; 29 -0.25,2.435; 30 -0.75,2.435; 31 -1.25,2.435; 32 -1.75,2.435 | smd 3.45 x 3.45: 33 0,0
SON50P300X300X100-11N = smd 0.813 x 0.305: 1 -1.473,0.991; 2 -1.473,0.508; 3 -1.473,0; 4 -1.473,-0.508; 5 -1.473,-0.991; 6 1.473,-0.991; 7 1.473,-0.508; 8 1.473,0; 9 1.473,0.508; 10 1.473,0.991 | smd 1.651 x 2.388: 11 0,0
MF-SMDF050 = smd 1.5 x 4.6: 1 -2.45,0; 2 2.45,0
QFN-32 = smd 0.285 x 0.8: 1 -1.75,-2.5; 2 -1.25,-2.5; 3 -0.75,-2.5; 4 -0.25,-2.5; 5 0.25,-2.5; 6 0.75,-2.5; 7 1.25,-2.5; 8 1.75,-2.5; 17 1.75,2.5; 18 1.25,2.5; 19 0.75,2.5; 20 0.25,2.5; 21 -0.25,2.5; 22 -0.75,2.5; 23 -1.25,2.5; 24 -1.75,2.5 | smd 0.8 x 0.285: 9 2.5,-1.75; 10 2.5,-1.25; 11 2.5,-0.75; 12 2.5,-0.25; 13 2.5,0.25; 14 2.5,0.75; 15 2.5,1.25; 16 2.5,1.75; 25 -2.5,1.75; 26 -2.5,1.25; 27 -2.5,0.75; 28 -2.5,0.25; 29 -2.5,-0.25; 30 -2.5,-0.75; 31 -2.5,-1.25; 32 -2.5,-1.75 | smd 3.15 x 3.15: EP 0,0
TOUCH_BUTTON = drill 0.6: P$1 6.5,0 | hole 1.75: 0,0
R0805_2 = smd 1.5 x 1.3: 1 0,-2.22; 2 0,-0.32 | smd 1.3 x 1.5: 3 2.22,0; 4 0.32,0
SOT95P230X110-3N = smd 1.26 x 0.59: 1 -0.98,0.95; 2 -0.98,-0.95; 3 0.98,0
BATTERY_HOLDER = smd 1.27 x 2.54: P$1 5.08,54.61; P$2 12.7,54.61
R0402 = smd 0.7 x 0.9: 1 -0.65,0; 2 0.65,0
FLIPCHIP = smd 0.255 x 0.255: A1 -0.5,0.2; A2 -0.5,-0.2; B1 0.5,0.2; B2 0.5,-0.2
WHEEL6 = drill 0.6: SEG1 -3,11; SEG2 7,9; SEG3 11,-2; SEG4 3,-11; SEG5 -7,-9; SEG6 -11,3
XTAL_ECS-160-12-36-AGN-TR = smd 1.2 x 1: 1 -0.85,-0.65; 2 0.85,-0.65; 3 0.85,0.65; 4 -0.85,0.65
XTAL_NX2012SA-32.768K-STD-MUB-1 = smd 1 x 1.25: 1 -0.75,0; 2 0.75,0

### Placement (x,y rotation side)
ANT2  31.46,91.49 0 bottom
C1  26.42,101.09 90 bottom
C2  28.45,101.09 270 bottom
C3  56.34,59.42 270 bottom
C4  47.82,51.43 180 bottom
C5  56.9,74.68 90 top
C6  54.86,74.68 90 top
C7  50.18,64.51 270 bottom
C8  54.25,59.71 90 bottom
C9  47.82,53.53 180 bottom
C10  47.82,59.13 180 bottom
C11  51.12,60.13 270 bottom
C12  56.9,74.68 90 bottom
C13  54.86,74.68 90 bottom
C14  3.3,23.5 90 bottom
C15  5.55,23.5 90 bottom
C16  14.5,31.95 270 bottom
C17  16.7,32 270 bottom
C18  8.8,20.03 90 bottom
C19  5.08,101.35 90 bottom
C20  17.53,101.35 90 bottom
C21  13.46,101.35 90 bottom
C22  10.92,101.35 90 bottom
C23  15.49,101.35 270 bottom
C24  20.07,94.74 270 bottom
C25  22.1,94.74 270 bottom
C26  10.81,97.03 0 bottom
C27  11.94,90.42 90 bottom
C28  2.29,97.03 90 bottom
C29  4.32,97.03 90 bottom
C30  9.91,90.42 90 bottom
C31  53.2,4.9 270 bottom
C32  57.04,13.36 90 bottom
C33  55.3,9 270 bottom
C34  37.59,55.12 270 bottom
C53  31.46,75.23 270 bottom
C54  33.23,75.23 270 bottom
C55  26.63,88.44 90 bottom
C56  24.85,88.44 90 bottom
C57  35.27,85.65 180 bottom
C58  38.06,85.01 90 bottom
C59  37.55,80.82 180 bottom
C60  40.35,77.27 180 bottom
C61  41.36,81.08 90 bottom
C62  43.14,81.08 90 bottom
C63  41.87,87.43 270 bottom
C64  19.77,84.63 0 bottom
C65  21.04,89.71 180 bottom
C66  36.79,88.31 180 bottom
C67  35.27,90.98 90 bottom
C68  19.01,70.15 270 bottom
C69  29.55,87.3 0 bottom
C70  29.55,88.57 0 bottom
D2  43.44,64.19 270 bottom
D4  43.65,84.89 270 bottom
D5  7.11,95.5 90 bottom
D6  11.43,94.23 180 bottom
D7  8.13,100.84 90 bottom
HM1  55.72,70.24 180 bottom
IC1  55.63,70.36 180 top
J1  21.09,115.62 0 bottom
JMP2  45.17,80.57 180 bottom
JP3  4.32,80.01 90 bottom
JP5  4.32,71.88 90 bottom
JP7  55.58,81.75 90 bottom
JP8  4.27,90.38 270 bottom
L1  43.18,56.9 270 bottom
L2  16.26,95.76 270 bottom
LED1  10,38.5 180 bottom
LED2  50.5,38.5 180 bottom
LED3  10,10 180 bottom
LED4  50.5,10 180 bottom
LED5  23.88,42.16 180 bottom
LED6  36.07,42.16 180 bottom
LS1  49.91,24.56 180 bottom
MK1  55.9,4.9 0 bottom
PROXI  19.33,34.73 0 top
Q1  33.36,14.94 0 bottom
Q2  30.72,101.25 90 bottom
Q3  FDN304PZ  [SOT23']  29.97,60.45 180 bottom
R2  39.88,63.25 270 bottom
R3  35.05,95 180 bottom
R4  35.46,11.01 0 bottom
R5  39.88,59.18 90 bottom
R6  36.37,14.96 270 bottom
R7  7.5,41.6 180 bottom
R8  25.65,91.69 180 bottom
R9  47.82,61.23 0 bottom
R10  27.18,60.96 90 bottom
R11  7.5,35.4 180 bottom
R12  47.9,41.65 180 bottom
R13  47.99,35.35 180 bottom
R14  7.5,13.15 180 bottom
R15  26.92,97.03 90 bottom
R16  31.75,97.03 90 bottom
R17  39.88,55.12 90 bottom
R19  7.49,6.85 180 bottom
R22  21.32,45.32 180 bottom
R23  21.32,39.01 180 bottom
R24  33.51,45.31 180 bottom
R25  33.61,39.02 180 bottom
R28  47.9,13.15 180 bottom
R29  47.91,6.85 180 bottom
R30  39.84,84.89 90 bottom
R31  42.12,97.59 90 bottom
R32  27.9,78.03 270 bottom
R33  29.68,77.52 270 bottom
R34  21.8,81.08 270 bottom
R35  16.72,71.68 90 bottom
R36  24.85,80.57 90 bottom
R37  22.57,77.77 180 bottom
S3  41.62,92.51 90 bottom
S4  16.72,77.77 90 bottom
TP1  34.29,97.28 0 bottom
TP2  9.65,116.33 0 bottom
TP3  9.65,113.79 0 bottom
TP4  50.04,71.88 0 bottom
TP5  17.65,89.15 0 bottom
TP6  48.26,68.83 0 bottom
U2  57.01,65.48 180 bottom
U3  31.46,82.35 90 bottom
U4  47.9,56.32 180 bottom
U$1  35.05,61.21 180 bottom
U$2  12.96,25.44 315.2 bottom
U$3  10,38.5 0 top
U$4  50.5,38.5 180 top
U$5  10,10 0 top
U$6  53.62,51.43 90 bottom
U$9  53.2,63.42 0 bottom
U$10  39.88,2.03 0 bottom
U$11  7.35,46.8 0 top
U$12  23.29,100.36 90 bottom
U$13  50.5,10 180 top
U$14  24.65,98.06 0 bottom
U$15  37.42,89.84 180 bottom
U$16  31.46,86.16 270 bottom
U$17  31.46,87.93 90 bottom
U$18  29.21,64.77 270 bottom
U$19  30.25,24.25 90 top
Y3  21.55,87.17 270 bottom
Y4  34.25,87.93 270 bottom

### Tracks (layer width: path | path; a pad name or v marks a point on that pad's centre or on a via)
+3V3  (via drill 0.2, 0.2 pad 0.2, 0.3, 0.35)  (17 unrouted)
  Top 0.203: 22.5,39.7 22.8,39.7 | v45.97,22.86 46.74,23.62 v52.07,23.62
  Top 0.254: v24.85,78.28 22.82,76.25 v22.57,76.25 22.52,76.2 20.57,76.2 20.07,75.69 12.7,75.69 v10.16,78.23 | v19.4,36.3 22.8,39.7 v24.7,39.7 | v28.9,42.7 31.2,45 v40.5,45 v45.1,45 | v19.4,42.8 22.5,39.7 | v50.42,54.63 46.71,54.63 v45.17,53.09 | C12.1 C13.1 54.42,73.73 v53.59,72.9 53.59,70.87 54.1,70.36 IC1.5
  Top 0.508: v45.17,53.09 45.17,54.31 52.58,61.72 52.58,65.28 | 52.58,65.28 52.58,72.14 53.34,72.9 v53.59,72.9 | v27.43,108.71 21.59,108.71 19.56,106.68 19.56,98.55 v20.32,97.79 | v29.72,70.36 43.43,70.36 48.51,65.28 52.58,65.28
  Bottom 0.203: 38.24,42.74 v40.5,45 | R6.2 39.92,14.01 45.72,19.81 45.72,22.61 v45.97,22.86 | 11.56,10.67 11.55,10.67
  Bottom 0.254: U3.19 30.71,86.14 30.44,86.41 27.66,86.41 C55.1 C56.1 24.83,87.44 23.62,88.65 23.62,90.17 23.88,90.42 25.4,90.42 25.4,90.49 R8.2 26.67,91.69 28.96,93.98 34.99,93.98 R3.2 | U3.24 33.23,84.81 33.23,85.39 33.49,85.65 C57.1 34.27,85.63 35.33,84.57 37.5,84.57 C58.1 38.06,84.38 38.55,84.86 39.05,84.86 | 39.05,84.86 39.84,85.65 R30.2 | D4.2 44.75,83.87 | 44.75,83.87 44.75,82.69 JMP2.3 | U3.6 30.71,79.24 30.71,76.98 C53.1 C54.1 29.76,76.23 29.42,76.57 | R32.2 27.33,76.5 25.61,76.5 24.85,77.27 v24.85,78.28 | R34.2 22.57,78.91 v22.57,76.25 | 39.05,84.86 40.7,84.86 41.7,83.87 44.75,83.87 | 11.55,37.92 11.55,39.08 15.28,42.8 v19.4,42.8 | v52.07,23.62 52.05,27.4 52.07,27.4 LS1.2 | U$2.13 9.65,22.5 7.7,22.5 | C16.1 14.55,32.95 C17.1 16.7,33.6 v19.4,36.3 | 7.7,22.5 6.7,21.5 6.7,18.1 11.55,13.25 11.55,10.67 11.55,9.43 15.78,5.2 52.55,5.2 C31.1 | C14.1 C15.1 7.65,22.55 7.7,22.5 | v24.7,39.7 25.53,40.53 | 28.86,42.74 v28.9,42.7 | C33.1 54.77,9.43 | C31.1 53.61,6.26 | 46.57,53.53 C9.1 46.87,53.43 | 46.87,53.43 C4.1 46.87,48.58 50.45,45 | U4.10 49.77,55.33 50.42,54.69 v50.42,54.63 | 46.53,53.09 46.87,53.43 | 52.15,43.3 50.45,45 | v45.1,45 50.45,45 | C31.1 53.2,7.15 52.05,8.3 52.05,9.32 | J1.16 19.3,117.46 19.3,98.89 20.32,97.88 v20.32,97.79 20.32,98.42 19.84,98.9 J1.15 | C25.1 22.43,96.03 U$14.3 | HM1.5 57.79,70.24 58.42,70.87 58.42,72.2 C12.1 C13.1 54.04,72.9 v53.59,72.9 | v10.16,78.23 10.16,77.47 5.59,72.9 JP5.2
  Bottom 0.305: R33.2 29.42,76.57 28.41,76.57 R32.2 | U4.1 46.22,55.33 45.82,54.93
  Bottom 0.508: 46.57,53.53 45.82,54.27 45.82,54.93 | 46.53,53.09 v45.17,53.09 | C25.1 C24.1 | v53.59,72.9 53.59,77.22 48.51,82.3 | 48.51,82.3 48.49,82.27 JMP2.3 | 48.51,82.3 46.23,84.58 46.23,99.82 45.21,100.84 37.34,100.84 | 37.34,100.84 34.8,100.84 27.43,108.2 v27.43,108.71 | R3.2 36,99.5 37.34,100.84 | C53.1 30.51,76.23 29.72,75.44 v29.72,70.36 | L2.1 17.47,98.36 20.07,95.76 C24.1 | v20.32,97.79 20.32,95.95 C24.1
+3V3_RTC
  Bottom 0.254: U$9.2 51.26,62.47 C7.2 49.87,63.25 43.89,63.25 D2.2 | U$9.2 54.18,60.73 C8.2 | U$9.2 55.76,62.47 56.27,61.96 C3.1 56.9,62.52 56.9,64.52 56.74,64.68 U2.P$2
ADC1  (via drill 0.2, 0.2 pad 0.2)
  Top 0.254: v48.26,48.51 43.69,48.51 27.43,64.77 v27.43,69.85 | v26.67,75.69 28.7,77.72 28.7,82.8 28.07,83.44 v27.23,83.44
  Bottom 0.254: U3.15 27.39,83.6 v27.23,83.44 | C32.2 57.04,44.63 53.15,48.51 v48.26,48.51 | v27.43,69.85 27.43,74.93 v26.67,75.69
ADC2  (via drill 0.2, 0.2 pad 0.2)
  Top 0.254: v37.59,78.74 37.59,81.28 32.77,86.11 28.61,86.11 v26.38,83.87
  Bottom 0.254: U3.16 26.6,84.1 v26.38,83.87 | C34.1 37.59,56.9 36.07,58.42 36.07,69.34 37.59,70.87 v37.59,78.74
  Bottom 0.508: C34.1 R17.2 R5.1
BS
  Bottom 0.254: J1.8 23.34,105.18 23.88,104.65 23.88,104.14 24.65,103.36 U$14.2
BUSY_N
  Bottom 0.254: J1.9 22.84,104.92 23.37,104.39 23.37,102.66 U$12.3
BUT1
  Bottom 0.254: U$2.32 19.39,29.38 19.39,32.73 21.2,34.54 21.2,35.7 18.4,38.5 U$3.P$1
BUT2
  Bottom 0.254: U$2.1 16.67,24.9 20.27,28.5 20.27,31.7 25.61,37.04 42.55,37.04 U$4.P$1
BUT3
  Bottom 0.254: U$5.P$1 16.6,10.1 16.6,19.31 U$2.8
BUT4
  Bottom 0.254: U$2.9 12.21,22.23 12.21,21.54 14.12,19.63 14.12,9.4 15.72,7.8 41.8,7.8 U$13.P$1
DC
  Bottom 0.254: J1.11 21.84,104.9 21.07,104.13 U$12.1
DIO0  (via drill 0.2)
  Top 0.254: v26.16,79.5 26.16,81.03 24.64,82.55 24.64,91.69 | v21.08,105.16 21.34,105.41 22.61,105.41 24.64,103.38 24.64,91.69 | v22.61,91.69 24.64,91.69
  Bottom 0.254: R36.1 24.97,79.5 v26.16,79.5 | v21.08,105.16 21.34,105.41 21.34,106.93 20.83,107.44 20.83,117.48 J1.13 | R8.1 v22.61,91.69 19.05,91.69 17.78,90.42 17.78,89.28 TP5.TP
DIO1  (via drill 0.2)
  Top 0.254: v20.44,77.85 20.44,92.07 23.37,95 v23.37,95.5
  Bottom 0.254: R37.1 21.54,77.85 v20.44,77.85 | v23.37,95.5 23.37,99.96 U$12.2
DIO2  (via drill 0.2, 0.2 pad 0.2)
  Top 0.254: v27.14,80.82 25.15,82.81 25.15,93.98 | v20.57,106.17 22.61,106.17 25.15,103.63 25.15,93.98 | v26.16,93.98 25.15,93.98
  Bottom 0.254: U3.10 27.41,81.1 v27.14,80.82 | J1.14 20.34,106.41 v20.57,106.17 | TP1.TP 34.29,95.18 R3.1 33.85,94.74 28.96,94.74 28.45,94.23 26.42,94.23 v26.16,93.98
DIO3  (via drill 0.2, 0.2 pad 0.2)
  Top 0.254: v41.19,10.91 41.19,12.79 47.5,19.1 v53.6,19.1 | v48.77,47.75 43.18,47.75 26.67,64.26 v26.67,68.83 | v25.91,75.18 25.91,75.69 27.94,77.72 27.94,80.27 v27.9,80.31
  Bottom 0.254: U3.9 28.18,80.6 v27.9,80.31 | R4.1 36.5,10.91 v41.19,10.91 | v53.6,19.1 56.08,21.58 56.08,44.67 53,47.75 v48.77,47.75 | v25.91,75.18 26.67,74.42 v26.67,68.83
DIO6  (via drill 0.2 pad 0.2)
  Top 0.254: IC1.2 57.91,70.36 58.42,70.87 58.42,74.42 58.17,74.68 48.26,74.68 47.24,73.66 35.32,73.66 v31.46,77.52
  Bottom 0.254: U3.5 31.21,77.77 v31.46,77.52
DIO7  (via drill 0.2, 0.2 pad 0.2)
  Top 0.254: v32.53,77.52 35.63,74.42 v46.23,74.42
  Bottom 0.254: U3.4 31.71,78.29 32.53,77.46 v32.53,77.52 | HM1.4 56.53,71.88 52.32,71.88 49.78,74.42 v46.23,74.42
DIO12  (via drill 0.2, 0.2 pad 0.2)
  Top 0.254: v58.17,68.07 57.02,68.07 v56.64,68.45 | v42.93,76.71 38.35,76.71 36.58,78.49 36.58,79.11 v35.37,80.31
  Bottom 0.203: 33.9,81.58 34.5,81.58 34.71,81.37 34.71,81.04 35.37,80.38 v35.37,80.31
  Bottom 0.254: U3.30 33.9,81.58 | U2.P$6 58.17,67.14 v58.17,68.07 | v56.64,68.45 51.18,68.45 v42.93,76.71
DIO13  (via drill 0.2, 0.2 pad 0.2)
  Top 0.254: v35.81,76.96 35.81,78.74 34.54,80.01 34.54,80.77 35.08,81.31 v35.37,81.31 | v7.37,72.64 8.13,73.41 34.04,73.41 34.8,72.64 v35.81,72.64
  Bottom 0.254: U3.29 34.59,82.09 v35.37,81.31 | U$2.14 9.95,23.5 8.8,23.5 3.56,28.74 3.56,49.78 7.37,53.59 v7.37,72.64 | v35.81,76.96 v35.81,72.64
DIO14
  Bottom 0.254: U3.13 22.7,82.6 22.63,82.67 21.87,82.67 21.8,82.6 R34.1 21.65,82.32 S4.2 | 18.97,71.14 C68.1 19.01,73.19 S4.1 18.97,74.24 17.78,75.44 17.78,80.77 18.97,81.97 S4.2 | S4.2 17.76,82.32 16.01,84.07 11.68,84.07 6.35,89.41 6.35,91.19 5.88,91.65 JP8.1
GDR
  Bottom 0.254: J1.2 26.34,108.28 31.37,103.25 Q2.1 31.37,98.36 R16.2
GND  (via drill 0.2, 0.2 pad 0.2)  (373 unrouted)
  Top 0.254: v2.79,45.21 v1.52,45.21
  Bottom 0.203: U3.31 32.75,81.1 v32.73,81.08 | C57.2 36.27,86.65 v36.79,87.17
  Bottom 0.254: C57.2 37.7,85.65 C58.2 | U$2.24 12.96,27.93 U$2.EP 11.91,25.44 U$2.19 | U4.9 48.4,55.82 U4.11 | U2.P$7 58.66,66.28 58.76,66.38 v58.76,70.03 | U3.33 v30.19,83.62
  Bottom 0.508: U$10.P$2 R10.1
  other vias: 32.73,82.35 32.73,83.62 32.09,81.71 32.09,82.98 31.46,81.08 31.46,82.35 31.46,83.62 30.82,81.71 30.82,82.98 30.19,81.08 30.19,82.35 32.47,89.71 32.47,88.95 32.47,88.19 33.23,89.71 30.44,89.71 29.68,89.71 28.92,90.47 28.92,89.71 28.92,91.24 28.92,92 28.92,92.76 30.44,93.27 29.68,93.27 31.2,93.27 31.96,93.27 32.73,93.27 33.49,93.27 34,92.76 34,92 34,91.24 34,90.47 34,89.71 28.15,89.71 27.9,88.95 27.9,88.19 27.9,87.43 26,85.27 22.95,85.27 22.18,85.27 20.66,72.57 20.41,71.55 20.41,70.53 20.41,69.52 15.58,76.63 15.58,77.9 15.58,80.44 15.58,79.17 16.85,76.63 16.85,77.9 16.85,79.17 16.85,80.44 17.36,81.71 16.34,81.71 15.84,82.73 22.18,83.74 23.2,83.74 19.64,86.28 18.12,86.28 17.61,83.49 13.8,76.63 13.8,77.9 13.8,79.17 13.8,80.44 42.76,72.57 40.47,72.82 45.55,70.53 41.23,83.23 42.76,83.23 42,83.23 43.52,83.23 43.27,86.03 43.01,89.58 41.74,89.58 40.47,89.58 40.47,90.86 40.47,92.12 40.47,93.39 40.47,94.67 41.74,94.67 43.01,94.67 43.01,93.39 43.01,92.12 43.01,90.86 41.74,90.86 41.74,92.12 41.74,93.39 37.42,90.86 38.19,91.62 37.42,92.38 38.19,93.14 36.66,93.14 35.65,93.14 34.88,93.14 14.56,69.77 14.56,70.79 14.56,71.55 57.24,72.31 51.65,71.3 52.16,73.58 32.98,100.38 34.25,99.36 38.82,99.87 37.3,98.09 35.56,102.87 36.83,102.87 16.47,106.98 14.18,106.98 9.61,104.7 6.56,103.68 16.22,95.81 28.66,97.08 28.41,98.86 25.74,83.23 14.18,90.22 15.84,86.79 11.01,87.3 8.47,83.49 4.66,87.05 7.96,91.36 4.15,93.9 2.12,90.35 2.12,87.3 8.47,79.93 8.98,74.85 12.28,70.79 28.79,85.27 39.37,102.87 40.64,102.87 41.91,102.87 43.18,102.87 38.1,102.87 31.75,106.68 33.02,105.41 34.29,104.14 31.75,107.95 31.75,111.76 31.75,110.49 31.75,109.22 31.75,113.03 33.02,116.84 34.29,116.84 35.56,116.84 36.83,116.84 31.75,116.84 39.37,116.84 40.64,116.84 41.91,116.84 43.18,116.84 38.1,116.84 31.75,115.57 31.75,114.3 44.45,102.87 45.72,102.87 48.26,102.87 46.99,102.87 44.45,116.84 45.72,116.84 48.26,116.84 49.53,116.84 50.8,116.84 52.07,116.84 46.99,116.84 48.26,87.63 49.53,87.63 50.8,87.63 52.07,87.63 48.26,91.44 48.26,90.17 48.26,88.9 48.26,92.71 48.26,96.52 48.26,95.25 48.26,93.98 48.26,97.79 48.26,101.6 48.26,100.33 48.26,99.06 57.15,102.87 57.15,106.68 57.15,105.41 57.15,104.14 57.15,107.95 57.15,111.76 57.15,110.49 57.15,109.22 57.15,113.03 53.34,116.84 54.61,116.84 55.88,116.84 57.15,116.84 57.15,115.57 57.15,114.3 53.34,87.63 54.61,87.63 55.88,87.63 57.15,87.63 57.15,91.44 57.15,90.17 57.15,88.9 57.15,92.71 57.15,96.52 57.15,95.25 57.15,93.98 57.15,97.79 57.15,101.6 57.15,100.33 57.15,99.06 14.48,53.09 15.75,53.09 18.29,53.09 19.56,53.09 20.83,53.09 22.1,53.09 17.02,53.09 14.48,56.9 14.48,55.63 14.48,54.36 14.48,58.17 14.48,67.06 15.75,67.06 18.29,67.06 19.56,67.06 20.83,67.06 22.1,67.06 17.02,67.06 23.37,53.09 24.64,53.09 24.64,56.9 24.64,55.63 24.64,54.36 24.64,58.17 24.64,61.98 24.64,60.71 24.64,59.44 24.64,63.25 23.37,67.06 24.64,67.06 24.64,65.79 24.64,64.52 3.81,54.1 5.08,54.1 3.81,57.91 5.08,57.91 3.81,56.64 5.08,56.64 3.81,55.37 5.08,55.37 3.81,59.18 5.08,59.18 3.81,62.99 5.08,62.99 3.81,61.72 5.08,61.72 3.81,60.45 5.08,60.45 3.81,64.26 5.08,64.26 3.81,68.07 5.08,68.07 3.81,66.8 5.08,66.8 3.81,65.53 5.08,65.53 2.29,108.2 3.56,108.2 6.1,108.2 4.83,108.2 2.29,112.01 6.1,112.01 2.29,110.74 6.1,110.74 2.29,109.47 6.1,109.47 2.29,113.28 6.1,113.28 2.29,117.09 3.56,117.09 6.1,117.09 4.83,117.09 2.29,115.82 6.1,115.82 2.29,114.55 6.1,114.55 10.67,67.06 11.94,67.06 13.21,67.06 10.67,58.17 11.94,58.17 13.21,58.17 10.67,61.98 10.67,60.71 10.67,59.44 10.67,63.25 10.67,65.79 10.67,64.52 16.09,91.24 13.68,97.84 23.71,93.78
  pour Bottom: -1.27,120.65 -1.27,-1.27 62.23,-1.27 62.23,121.92 60.96,121.92 -1.27,121.92
  pour Top: -2.54,123.19 -2.54,50.8 63.5,50.8 63.5,123.19
  pour Top: 33.36,80.44 29.55,80.44 29.55,84.25 33.36,84.25
JTCK  (via drill 0.2)
  Top 0.254: v33.27,78.74 30.99,78.74 26.67,74.42 10.67,74.42 7.62,77.47 JP3.4
  Bottom 0.254: U3.2 32.71,79.31 v33.27,78.74
JTMS  (via drill 0.2)
  Top 0.254: v34.04,78.23 33.78,77.98 33.02,77.98 32.77,78.23 31.24,78.23 26.92,73.91 6.6,73.91 JP3.2
  Bottom 0.254: U3.1 34.04,79.08 v34.04,78.23
L1
  Bottom 0.254: L1.1 45.4,56.83 U4.4
L2
  Bottom 0.254: L1.2 44.36,55.82 U4.2
LED0  (via drill 0.2)
  Top 0.254: v6.7,47.8 v2.15,47.8 | v8.4,26.9 4,26.9 v3.9,26.8
  Bottom 0.254: R22.1 20.37,47.07 21.1,47.8 | 21.1,47.8 30.5,47.8 | 30.5,47.8 40.8,47.8 R12.1 46.95,38.85 44.6,36.5 44.6,33.9 46.95,31.55 R28.1 | R24.1 32.56,45.74 30.5,47.8 | 21.1,47.8 8.4,47.8 | 8.4,47.8 6.55,45.95 R7.1 | 8.4,47.8 v6.7,47.8 | v2.15,47.8 2.1,47.75 2.1,28.6 | 2.1,28.6 2.1,17.6 R14.1 | U$2.17 9.32,25.98 v8.4,26.9 | v3.9,26.8 2.1,28.6
LED1
  Bottom 0.254: U$2.18 8.41,28.23 7.41,28.23 6.55,29.09 R11.1
LED2  (via drill 0.2)
  Top 0.254: v9.4,29.5 10.42,29.5 14.82,25.09 14.82,19.36 21.7,12.49 v21.7,10.2 | v49.6,22.4 37.3,10.1 v26.2,10.1
  Bottom 0.254: U$2.20 9.42,28.64 9.42,29.38 9.4,29.4 v9.4,29.5 | R13.1 47.04,34.26 49.6,31.7 v49.6,22.4 | v26.2,10.1 26.1,10.2 v21.7,10.2
LED3  (via drill 0.2)
  Top 0.254: v2.3,15.1 2.3,29.6 3.4,30.7 v7.4,30.7
  Bottom 0.254: R19.1 2.3,11.1 v2.3,15.1 | U$2.21 10,28.76 10,29.7 9,30.7 v7.4,30.7
LED4  (via drill 0.2)
  Top 0.254: v27.5,6.8 27.5,7.56 15.7,19.36 15.7,26.32 11.92,30.1 v10.9,30.1
  Bottom 0.254: U$2.22 11,28.47 11,30 v10.9,30.1 | v27.5,6.8 46.91,6.8 R29.1
LED5
  Bottom 0.254: U$2.23 11.6,28.57 11.6,29.5 12.8,30.7 12.8,37.2 15.6,40 19.38,40 R23.1
LED6  (via drill 0.2)
  Top 0.254: v13.8,29.4 14.9,29.4 15.8,28.5 16.8,28.5 17.8,29.5 17.8,31.2 v23,36.4
  Bottom 0.203: v23,36.4 25.62,39.02 25.8,39.02
  Bottom 0.254: U$2.25 13.8,28.75 v13.8,29.4 | R25.1 25.8,39.02
N$1
  Bottom 0.254: R2.1 41.28,65.59 D2.1
N$2  (1 unrouted)
N$3
  Bottom 0.254: LS1.1 44.91,20.75 40.08,15.91 R6.1 33.48,15.91 Q1.3
N$4
  Bottom 0.203: LED1.1 8.45,39.08
  Bottom 0.254: 8.45,39.08 R7.2
N$5
  Bottom 0.203: LED1.2 8.45,37.92
  Bottom 0.254: 8.45,37.92 R11.2
N$6
  Bottom 0.254: R4.2 34.31,11.21 Q1.1
N$7
  Bottom 0.203: LED3.1 8.45,10.57
  Bottom 0.254: 8.45,10.57 R14.2
N$8
  Bottom 0.508: U$18.2 30.92,64.99 Q3.2S 32.26,61.55 U$1.1
N$12
  Bottom 0.254: R9.1 50.97,61.23 C11.1 51.97,61.08 52.72,60.33 52.72,58.13 | 52.72,58.13 51.91,57.31 U4.6 | U4.8 50.12,56.32 51.02,55.43 52.22,55.43 52.72,55.93 | 52.72,55.93 52.72,58.13 | U$6.3 53.62,55.03 52.72,55.93
N$13
  Bottom 0.203: LED3.2 8.45,9.43
  Bottom 0.254: 8.45,9.43 8.45,6.86 R19.2
N$14
  Bottom 0.406: 28.97,61.61 Q3.1G
  Bottom 0.508: R10.2 28.66,61.91 28.78,61.8 | 28.78,61.8 28.97,61.61 | U$18.3 29.21,62.23 28.78,61.8
N$16
  Bottom 0.254: LED5.1 22.23,45.26 22.23,45.28 R22.2
N$17
  Bottom 0.254: LED5.2 22.23,39.07 22.23,39.05 R23.2
N$18
  Bottom 0.254: C16.2 14.7,30.8 14.7,28.23 U$2.27
N$19
  Bottom 0.254: U$2.30 17.4,28.81 17.4,30.35 C17.2
N$20
  Bottom 0.254: U$2.12 8.84,20.98 C18.2
N$21
  Bottom 0.254: U$2.11 10.9,22.33 10.9,19.88 10.1,19.08 C18.1
N$23
  Bottom 0.254: Q2.3 30.72,99.04 30.48,98.81 30.48,97.28 27.94,94.74 17.84,94.74 16.29,93.19 | L2.2 16.29,93.19 | 16.29,93.19 14.23,93.19 D6.2 13.18,95.61 C26.1
N$24
  Bottom 0.254: D5.2 8.13,98.27 D7.1 9.86,97.35 C26.2
N$25
  Bottom 0.254: R12.2 48.85,38.85 48.74,38.96 LED2.1
N$26
  Bottom 0.254: R13.2 48.94,37.92 LED2.2
N$28
  Top 0.254: 18.7,21.5 18.8,21.6
N$30
  Bottom 0.203: LED4.1 48.85,10.63
  Bottom 0.254: 48.85,10.63 R28.2
N$31
  Bottom 0.203: LED4.2 48.86,9.42 48.86,9.38
  Bottom 0.254: 48.86,9.38 R29.2
N$36
  Bottom 0.254: R24.2 34.35,45.2 LED6.1
N$37
  Bottom 0.254: LED6.2 34.35,39.22 R25.2
N$47
  Bottom 0.254: C60.1 39.35,78.03 C59.1 36.55,81.06 35.02,82.6 U3.28
N$48
  Bottom 0.254: U3.26 35.47,83.6 36.72,82.35 39.58,82.35 40.09,81.84 40.09,81.08 40.6,80.57 41.36,80.57 | 41.36,80.57 43.14,80.57 | 43.14,80.57 JMP2.2 | C62.1 43.14,80.57 | C61.1 41.36,80.57
N$49
  Bottom 0.254: S3.1 S3.2 42.54,97.06 R31.1
N$50
  Bottom 0.254: Y3.3 20.9,84.53 | U3.17 29.45,84.53 20.9,84.53 | 20.9,84.53 20.83,84.53 C64.1
N$51
  Bottom 0.254: U3.18 30.19,84.8 30.19,85.65 29.93,85.9 24.34,85.9 22.22,88.02 Y3.1 22.2,89.71 C65.2
N$52
  Bottom 0.254: C67.2 35.59,92.25 36.28,92.25 36.77,91.76 U$15.1 36.77,89.28 C66.2
N$53
  Bottom 0.254: U3.23 32.71,85.88 34.01,87.18 Y4.2 34.77,87.18 35.84,88.25 C66.1
N$54
  Bottom 0.254: C67.1 34.76,89.52 34.76,88.7 34.75,88.68 Y4.1 33.73,88.68 33.23,88.19 33.23,86.98 32.21,85.96 U3.22
N$55
  Bottom 0.254: U$16.A1 31.26,86.92 | 31.26,86.92 31.26,87.25 31.2,87.3 | U$17.1 31.46,87.12 31.26,86.92
  Bottom 0.305: U$17.1 31.44,87.3 31.2,87.3 C69.1
N$56
  Bottom 0.305: U$17.2 30.22,88.58 C70.1
  Bottom 0.61: U$17.2 ANT2.1
N$57
  Top 0.254: JP5.1 JP3.1
N$58
  Bottom 0.254: R35.2 16.58,73.22 S4.3 14.47,82.3 | 14.47,82.3 S4.4 | JP8.2 5.63,89.11 12.45,82.3 14.47,82.3
N$59
  Bottom 0.152: U3.20 31.26,84.83 U$16.B1
N$60
  Bottom 0.152: U3.21 31.66,84.83 U$16.B2
PROX
  Bottom 0.254: U$2.31 18.31,29.01 18.31,33.72 PROXI.P$1
  pour Top: 0,48.77 60.45,48.77 60.45,0 0,0
PROXI
  Bottom 0.254: U$2.5 18.22,19.81 33.81,19.81 U$19.SEG4
PS  (via drill 0.35)
  Top 0.254: v51.42,54.63 v51.42,56.43
  Bottom 0.254: U4.7 51.01,56.83 v51.42,56.43 | v51.42,54.63 51.4,54.63 U$6.1
RESE
  Bottom 0.254: J1.3 25.84,108.02 30.07,103.79 Q2.2 30.07,99.16 28.89,97.98 R15.2
RESETN  (via drill 0.2, 0.2 pad 0.2, 0.35 pad 0.2)
  Top 0.254: 39.33,92.22 39.33,83.11 39.58,82.85 v40.03,82.85 | 39.33,92.22 v39.37,92.25 | v16.6,29.5 16.6,33.5 18.3,35.2 18.3,41.63 arc90 13.45,46.48 v2.79,46.48 | JP3.10 10.92,85.09 | 10.92,85.09 18.29,92.46 | 18.29,92.46 22.35,96.52 v22.35,104.14 | 39.33,92.22 39.33,93.18 39.37,93.22 38.35,94.23 27.94,94.23 v26.92,93.22 | v10.92,82.55 10.92,85.09 | v18.29,91.95 18.29,92.46 | v10.92,72.14 6.86,68.07 v6.6,68.07
  Bottom 0.254: S3.4 v39.37,92.25 S3.3 40.4,86.92 41.43,86.92 C63.2 41.87,86.16 42.34,85.69 42.34,84.67 D4.3 | R30.1 39.84,83.62 39.08,82.85 | 39.08,82.85 38.98,82.76 36.88,82.76 35.55,84.1 U3.25 | 39.08,82.85 v40.03,82.85 | v16.6,29.5 16.6,28.72 U$2.29 | J1.10 v22.34,104.15 v22.35,104.14 | v10.92,72.14 v10.92,82.55 | v26.92,93.22 24.26,93.22 23.5,92.46 18.8,92.46 v18.29,91.95 | v2.79,46.48 3.05,46.74 3.05,50.55 6.6,54.1 v6.6,68.07
RXD  (via drill 0.2)
  Top 0.254: v35.05,78.49 35.05,76.71 36.07,75.69 49.28,75.69 55.37,81.79 55.54,81.79 JP7.2
  Bottom 0.254: U3.32 33.89,79.81 35.05,78.64 v35.05,78.49
SCL  (via drill 0.2, 0.2 pad 0.2)
  Top 0.254: v58.17,69.34 57.8,69.71 IC1.1 | v45.21,50.29 45.47,50.04 57.15,50.04 57.66,50.55 57.66,65.53 v57.15,66.04 | v26.12,78.28 24.13,76.29 v24.13,75.18 | v24.13,71.88 24.64,71.37 49.02,71.37 50.29,70.1 v50.29,67.56
  Bottom 0.254: U3.8 28.83,79.91 R32.1 27.07,78.98 26.38,78.28 v26.12,78.28 | U$2.15 9.94,24.2 8.9,24.2 4.32,28.78 4.32,49.78 5.59,51.05 44.45,51.05 v45.21,50.29 | HM1.6 58.06,69.24 v58.17,69.34 58.17,68.83 57.15,67.82 54.86,67.82 | v57.15,66.04 56.91,66.28 U2.P$4 55.14,66.28 54.86,66.55 54.86,67.82 | v24.13,75.18 v24.13,71.88 | 54.86,67.82 50.55,67.82 v50.29,67.56 49.53,67.56 TP6.TP
SDA  (via drill 0.2, 0.35 pad 0.2)
  Top 0.254: IC1.6 53.71,69.71 v53.34,69.34 53.34,67.82 54.1,67.06 v57.15,67.06 58.17,66.04 58.17,50.29 57.4,49.53 v44.96,49.53 | v26.12,77.27 26.12,77.18 v24.89,75.95 | v24.89,72.39 25.4,71.88 49.28,71.88 v51.31,69.85
  Bottom 0.254: U3.7 30.21,79.32 29.68,78.79 R33.1 29.36,78.47 28.92,78.03 26.88,78.03 v26.12,77.27 | U$2.16 8.95,24.92 5.08,28.79 5.08,49.78 5.84,50.55 43.94,50.55 v44.96,49.53 | HM1.1 53.44,69.24 v53.34,69.34 52.83,69.85 v51.31,69.85 50.04,71.12 TP4.TP | v57.15,67.06 57.13,67.08 U2.P$5 | v24.89,75.95 v24.89,72.39
SEG1  (via drill 0.35)
  Top 0.254: v16.76,24.13 18.03,24.13 19.25,22.91 U$19.SEG1
  Bottom 0.254: v16.76,24.13 16.02,24.13 U$2.2
SEG2
  Bottom 0.254: U$2.3 15.94,23.5 19.85,23.5 20.65,24.3 20.85,24.5 21.25,24.9 U$19.SEG2
SEG3
  Bottom 0.254: U$2.4 14.93,23.84 16.33,22.44 20.07,22.44 32.25,34.63 U$19.SEG3
SEG5
  Bottom 0.254: U$19.SEG5 20.07,17.25 U$2.6
SEG6
  Bottom 0.254: U$2.7 23.36,13.25 U$19.SEG6
SMPSFILT2
  Bottom 0.254: U3.27 35.34,83.1 36.54,81.9 39.32,81.9 39.48,81.74 39.48,79.91 40.52,78.87 JMP2.1
TDI  (via drill 0.2)
  Top 0.254: v19.05,79.76 9.91,79.76 7.11,82.55 JP3.8
  Bottom 0.254: U3.12 25.61,82.09 R36.2 24.02,81.52 23.58,81.08 20.28,81.08 19.05,79.85 v19.05,79.76
TDO  (via drill 0.2)
  Top 0.254: v21.08,75.18 11.94,75.18 7.11,80.01 JP3.6
  Bottom 0.254: U3.11 26.9,81.6 25.87,80.57 23.84,80.57 23.58,80.31 23.58,78.79 23.52,78.72 R37.2 23.52,75.59 23.11,75.18 v21.08,75.18
TXD  (via drill 0.2)
  Top 0.254: v33.53,77.47 35.81,75.18 51.55,75.18 JP7.1
  Bottom 0.254: U3.3 32.21,78.79 v33.53,77.47
V+
  Bottom 0.254: U4.5 45.82,57.91 45.82,58.68 46.87,59.73 C10.1
  Bottom 0.508: R2.2 38.58,62.3 U$1.2 38.58,60.13 R5.2 40.64,60.89 45.1,60.89 C10.1 R9.2
VBAT
  Bottom 0.508: U$10.P$1 31.24,56.64 29.97,57.91 Q3.3D
VCOM
  Bottom 0.254: C19.2 5.08,103.63 15.34,113.89 J1.24
VDD_18V
  Bottom 0.254: J1.18 18.34,112.25 17.53,111.44 C20.2
VGH
  Bottom 0.254: TP2.TP 9.65,117.86 10.41,118.62 16.51,118.62 16.84,118.29 J1.21 16.84,113.11 12.19,108.46 12.19,99.82 10.79,98.42 10.79,95.12 9.91,94.23 D6.1 9.68,91.6 C30.2 C27.2
VGL  (via drill 0.2)
  Top 0.254: v8.13,107.95 v8.13,105.66 | v6.6,99.31 v6.6,101.35
  Bottom 0.254: J1.23 15.84,113.63 8.13,105.92 v8.13,105.66 D7.2 7.85,102.59 v6.6,101.35 | TP3.TP 8.13,112.27 v8.13,107.95 | C28.2 C29.2 5.27,97.98 v6.6,99.31
VOTP
  Bottom 0.254: J1.19 17.84,112.58 15.49,110.24 C23.1
VSH
  Bottom 0.254: J1.20 17.34,112.84 13.46,108.97 C21.2
VSHR
  Bottom 0.254: J1.22 16.34,113.37 10.92,107.95 C22.2
VSL
  Bottom 0.254: J1.5 24.84,107.49 26.42,105.92 C1.2
VSLR
  Bottom 0.254: J1.4 25.34,107.75 28.45,104.65 C2.1
VSS  (via drill 0.35)
  Top 0.254: v9.78,98.55 v11.81,98.55
  Bottom 0.203: C22.1 9.78,99.25 v9.78,98.55 | v11.81,98.55 13.46,100.2 C21.1
  Bottom 0.254: C19.1 C22.1 | C21.1 C23.2 C20.1 18.03,100.4 18.03,100.33 18.84,101.14 J1.17
(copper drawn outside any net)
  shapes: Top area x3

### Text on the board
tPlace: Node#2 / V1.0